# Altium project SMU_V4 - Copy.PrjPcb (part 2 of 2)

## Sheet Relay.SchDoc
size C; SheetNumber: 8; SheetTotal: 15
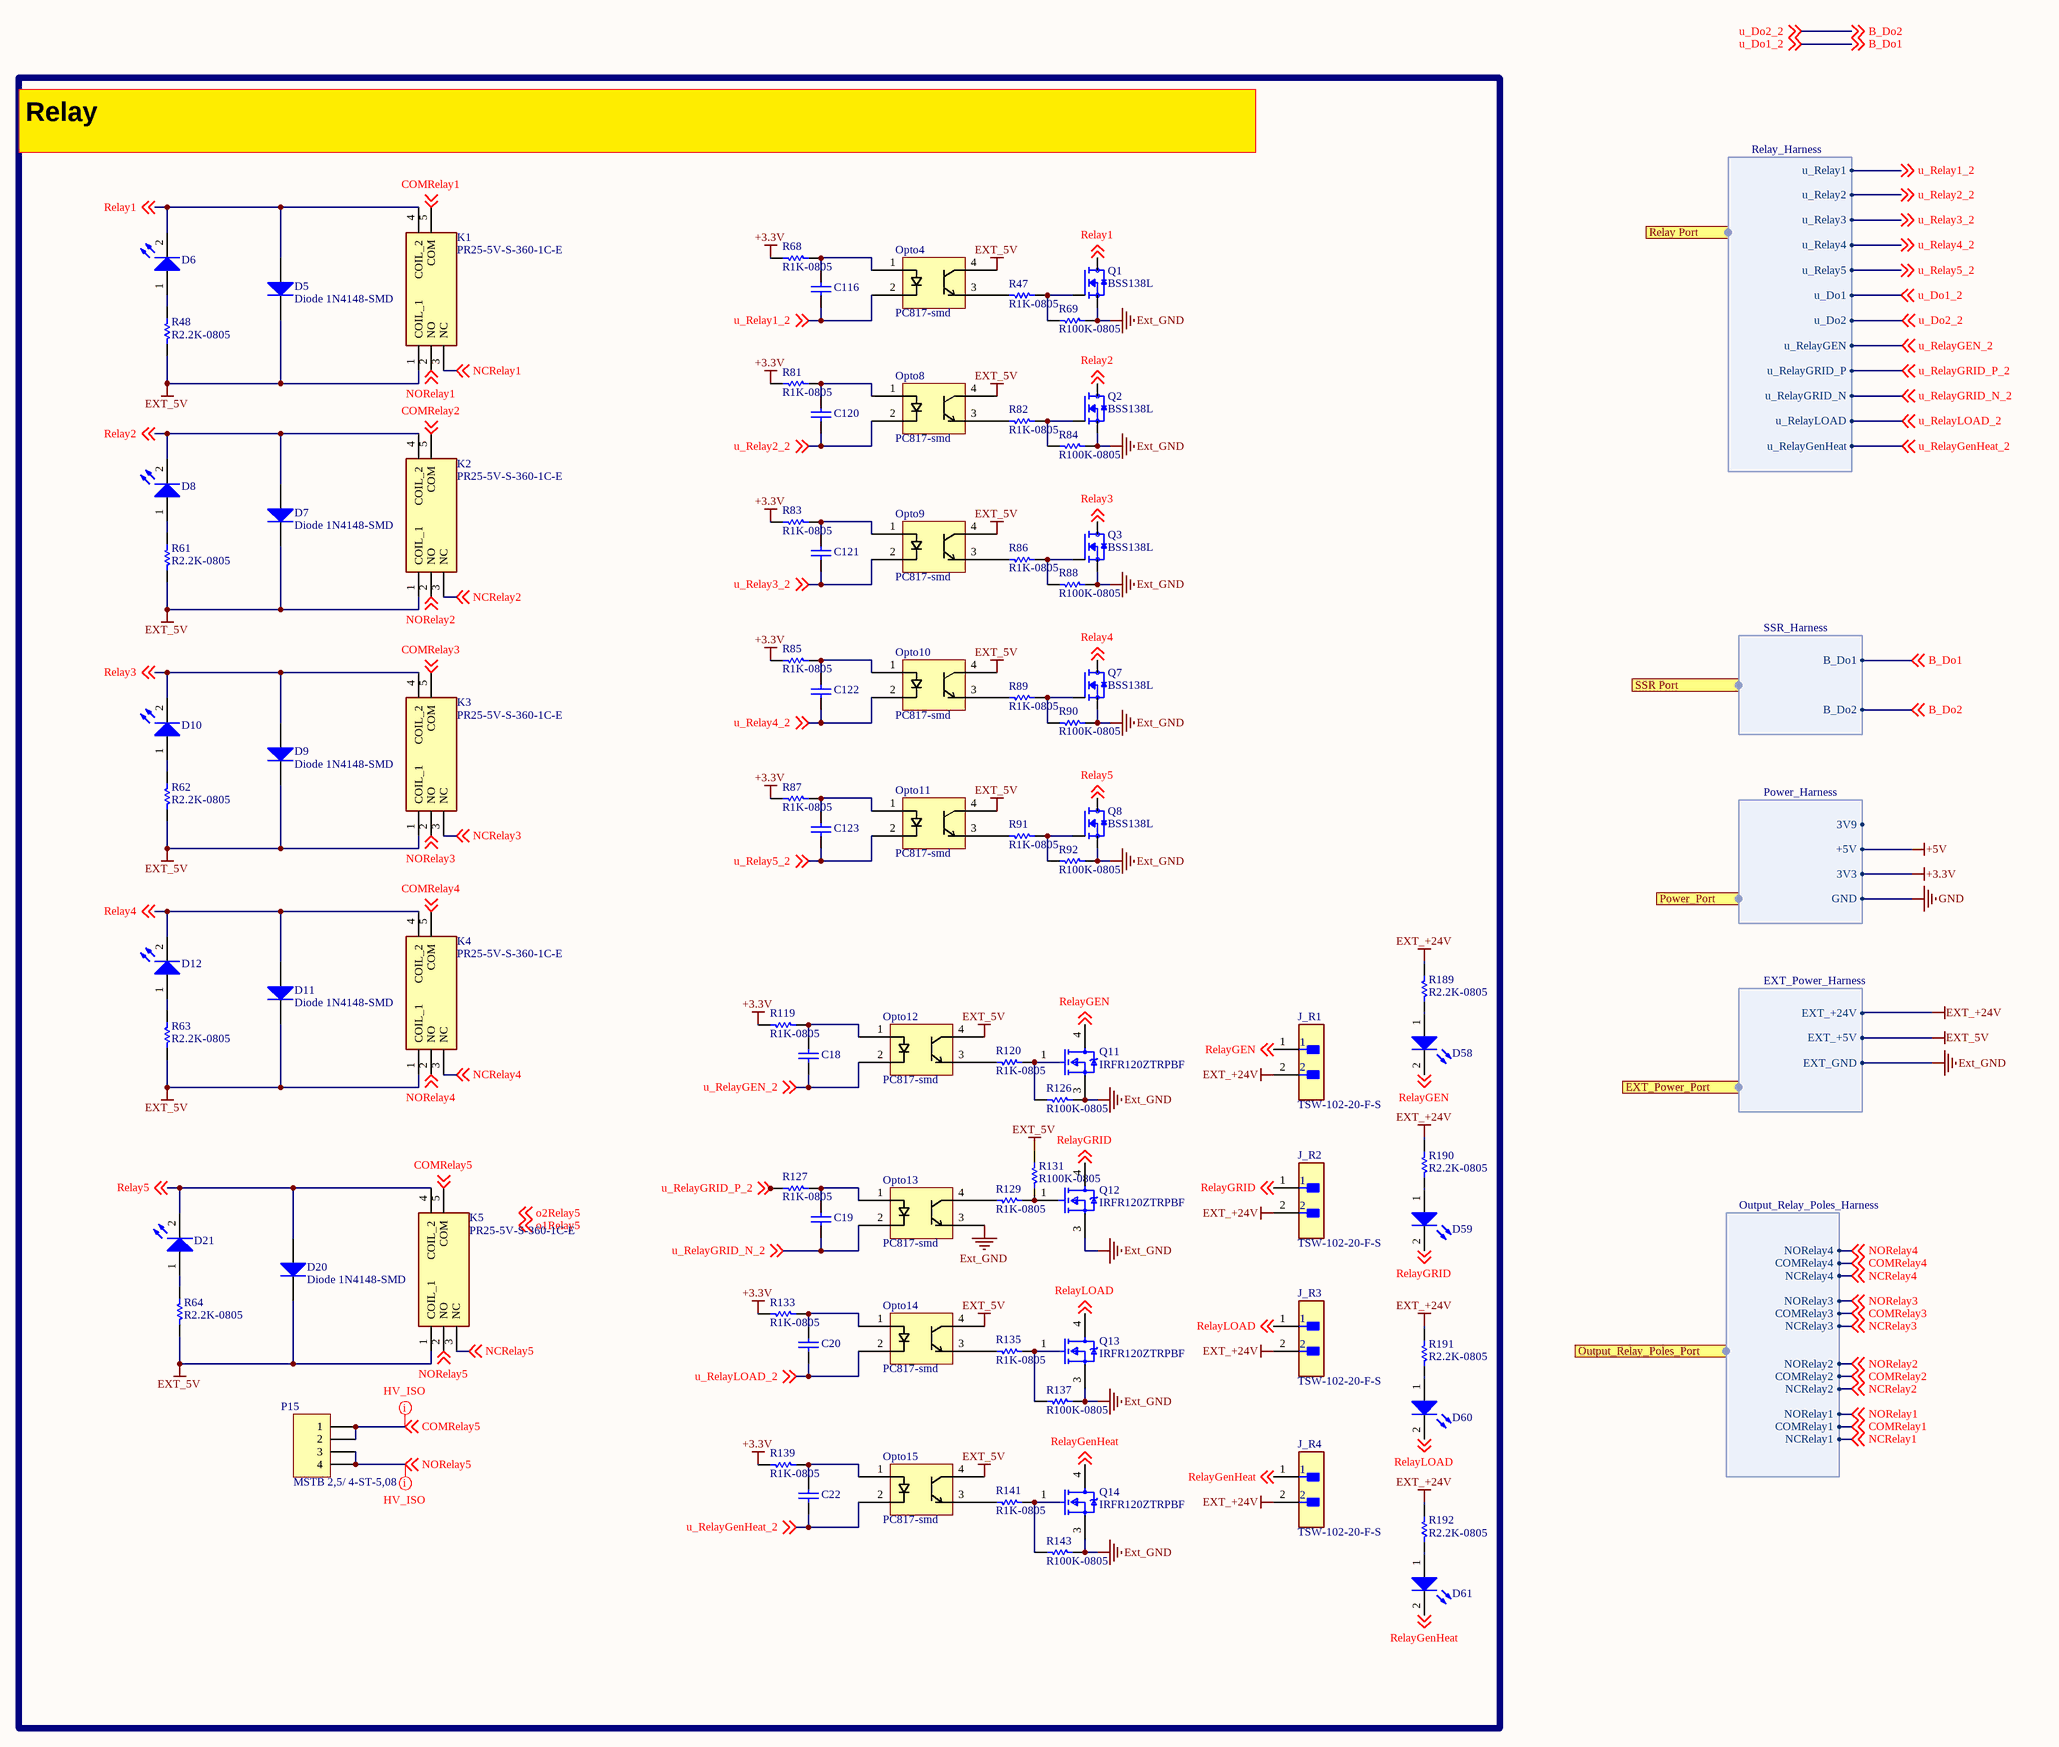
[diagram p7: Relay.SchDoc]

### Parts
C18  (no value)  [CRF06031]
C19  (no value)  [CRF06031]
C20  (no value)  [CRF06031]
C22  (no value)  [CRF06031]
C116  (no value)  [CRF06031]
C120  (no value)  [CRF06031]
C121  (no value)  [CRF06031]
C122  (no value)  [CRF06031]
C123  (no value)  [CRF06031]
D5  Diode 1N4148-SMD  [d1206]
D6  LED_0805_green  [0805-LED]  (value not drawn)
D7  Diode 1N4148-SMD  [d1206]
D8  LED_0805_green  [0805-LED]  (value not drawn)
D9  Diode 1N4148-SMD  [d1206]
D10  LED_0805_green  [0805-LED]  (value not drawn)
D11  Diode 1N4148-SMD  [d1206]
D12  LED_0805_green  [0805-LED]  (value not drawn)
D20  Diode 1N4148-SMD  [d1206]
D21  LED_0805_green  [0805-LED]  (value not drawn)
D58  LED_0805_green  [0805-LED]  (value not drawn)
D59  LED_0805_green  [0805-LED]  (value not drawn)
D60  LED_0805_green  [0805-LED]  (value not drawn)
D61  LED_0805_green  [0805-LED]  (value not drawn)
J_R1  TSW-102-20-F-S  [FP-TSW-102-12-T-S-MFG]
J_R2  TSW-102-20-F-S  [FP-TSW-102-12-T-S-MFG]
J_R3  TSW-102-20-F-S  [FP-TSW-102-12-T-S-MFG]
J_R4  TSW-102-20-F-S  [FP-TSW-102-12-T-S-MFG]
K1  PR25-5V-S-360-1C-E  [PR255VS3601CE]
K2  PR25-5V-S-360-1C-E  [PR255VS3601CE]
K3  PR25-5V-S-360-1C-E  [PR255VS3601CE]
K4  PR25-5V-S-360-1C-E  [PR255VS3601CE]
K5  PR25-5V-S-360-1C-E  [PR255VS3601CE]
Opto4  PC817-smd  [PC817_SMD1]
Opto8  PC817-smd  [PC817_SMD1]
Opto9  PC817-smd  [PC817_SMD1]
Opto10  PC817-smd  [PC817_SMD1]
Opto11  PC817-smd  [PC817_SMD1]
Opto12  PC817-smd  [PC817_SMD1]
Opto13  PC817-smd  [PC817_SMD1]
Opto14  PC817-smd  [PC817_SMD1]
Opto15  PC817-smd  [PC817_SMD1]
P15  MSTB 2,5/ 4-ST-5,08  [MSTB 2,5/4-G-5,08]
Q1  BSS138L  [BSS138L]
Q2  BSS138L  [BSS138L]
Q3  BSS138L  [BSS138L]
Q7  BSS138L  [BSS138L]
Q8  BSS138L  [BSS138L]
Q11  IRFR120ZTRPBF  [FP-PG-TO252-3-MFG]
Q12  IRFR120ZTRPBF  [FP-PG-TO252-3-MFG]
Q13  IRFR120ZTRPBF  [FP-PG-TO252-3-MFG]
Q14  IRFR120ZTRPBF  [FP-PG-TO252-3-MFG]
R47  R1K-0805  [CRF06031]
R48  R2.2K-0805  [CRF06031]
R61  R2.2K-0805  [CRF06031]
R62  R2.2K-0805  [CRF06031]
R63  R2.2K-0805  [CRF06031]
R64  R2.2K-0805  [CRF06031]
R68  R1K-0805  [CRF06031]
R69  R100K-0805  [CRF06031]
R81  R1K-0805  [CRF06031]
R82  R1K-0805  [CRF06031]
R83  R1K-0805  [CRF06031]
R84  R100K-0805  [CRF06031]
R85  R1K-0805  [CRF06031]
R86  R1K-0805  [CRF06031]
R87  R1K-0805  [CRF06031]
R88  R100K-0805  [CRF06031]
R89  R1K-0805  [CRF06031]
R90  R100K-0805  [CRF06031]
R91  R1K-0805  [CRF06031]
R92  R100K-0805  [CRF06031]
R119  R1K-0805  [CRF06031]
R120  R1K-0805  [CRF06031]
R126  R100K-0805  [CRF06031]
R127  R1K-0805  [CRF06031]
R129  R1K-0805  [CRF06031]
R131  R100K-0805  [CRF06031]
R133  R1K-0805  [CRF06031]
R135  R1K-0805  [CRF06031]
R137  R100K-0805  [CRF06031]
R139  R1K-0805  [CRF06031]
R141  R1K-0805  [CRF06031]
R143  R100K-0805  [CRF06031]
R189  R2.2K-0805  [CRF06031]
R190  R2.2K-0805  [CRF06031]
R191  R2.2K-0805  [CRF06031]
R192  R2.2K-0805  [CRF06031]

### Ports
EXT_Power_Port (harness EXT_Power_Harness), Output_Relay_Poles_Port (harness Output_Relay_Poles_Harness), Power_Port (harness Power_Harness), Relay Port (harness Relay_Harness), SSR Port (harness SSR_Harness)

### Harnesses
Relay_Harness: u_Relay1, u_Relay2, u_Relay3, u_Relay4, u_Relay5, u_Do1, u_Do2, u_RelayGEN, u_RelayGRID_P, u_RelayGRID_N, u_RelayLOAD, u_RelayGenHeat
SSR_Harness: B_Do1, B_Do2
Power_Harness: 3V9, +5V, 3V3, GND
EXT_Power_Harness: EXT_+24V, EXT_+5V, EXT_GND
Output_Relay_Poles_Harness: NCRelay1, NCRelay2, NCRelay3, NCRelay4, COMRelay1, COMRelay2, COMRelay3, COMRelay4, NORelay1, NORelay2, NORelay3, NORelay4

### Nets
+3.3V: R68.2 R81.2 R83.2 R85.2 R87.2 R119.2 R133.2 R139.2 ; port Power_Port.3V3
EXT_5V: D5.2(K) D7.2(K) D9.2(K) D11.2(K) D20.2(K) K1.1(COIL_1) K2.1(COIL_1) K3.1(COIL_1) K4.1(COIL_1) K5.1(COIL_1) Opto4.4 Opto8.4 Opto9.4 Opto10.4 Opto11.4 Opto12.4 Opto14.4 Opto15.4 R48.2 R61.2 R62.2 R63.2 R64.2 R131.2 ; port EXT_Power_Port.EXT_+5V
EXT_+24V: J_R1.2 J_R2.2 J_R3.2 J_R4.2 R189.2 R190.2 R191.2 R192.2 ; port EXT_Power_Port.EXT_+24V
Ext_GND: Opto13.3 Q1.S Q2.S Q3.S Q7.S Q8.S Q11.3(SOURCE) Q12.3(SOURCE) Q13.3(SOURCE) Q14.3(SOURCE) R69.2 R84.2 R88.2 R90.2 R92.2 R126.2 R137.2 R143.2 ; port EXT_Power_Port.EXT_GND
B_Do1: off-sheet B_Do1, off-sheet u_Do1_2, port Relay Port.u_Do1, port SSR Port.B_Do1  [also labelled u_Do1_2]
B_Do2: off-sheet B_Do2, off-sheet u_Do2_2, port Relay Port.u_Do2, port SSR Port.B_Do2  [also labelled u_Do2_2]
COMRelay1: K1.5(COM) ; off-sheet COMRelay1, port Output_Relay_Poles_Port.COMRelay1
COMRelay2: K2.5(COM) ; off-sheet COMRelay2, port Output_Relay_Poles_Port.COMRelay2
COMRelay3: K3.5(COM) ; off-sheet COMRelay3, port Output_Relay_Poles_Port.COMRelay3
COMRelay4: K4.5(COM) ; off-sheet COMRelay4, port Output_Relay_Poles_Port.COMRelay4
COMRelay5: K5.5(COM) P15.1 P15.2 ; off-sheet COMRelay5
NCRelay1: K1.3(NC) ; off-sheet NCRelay1, port Output_Relay_Poles_Port.NCRelay1
NCRelay2: K2.3(NC) ; off-sheet NCRelay2, port Output_Relay_Poles_Port.NCRelay2
NCRelay3: K3.3(NC) ; off-sheet NCRelay3, port Output_Relay_Poles_Port.NCRelay3
NCRelay4: K4.3(NC) ; off-sheet NCRelay4, port Output_Relay_Poles_Port.NCRelay4
NCRelay5: K5.3(NC) ; off-sheet NCRelay5
NORelay1: K1.2(NO) ; off-sheet NORelay1, port Output_Relay_Poles_Port.NORelay1
NORelay2: K2.2(NO) ; off-sheet NORelay2, port Output_Relay_Poles_Port.NORelay2
NORelay3: K3.2(NO) ; off-sheet NORelay3, port Output_Relay_Poles_Port.NORelay3
NORelay4: K4.2(NO) ; off-sheet NORelay4, port Output_Relay_Poles_Port.NORelay4
NORelay5: K5.2(NO) P15.3 P15.4 ; off-sheet NORelay5
Relay1: D5.1(A) D6.2(K) K1.4(COIL_2) Q1.D ; off-sheet Relay1
Relay2: D7.1(A) D8.2(K) K2.4(COIL_2) Q2.D ; off-sheet Relay2
Relay3: D9.1(A) D10.2(K) K3.4(COIL_2) Q3.D ; off-sheet Relay3
Relay4: D11.1(A) D12.2(K) K4.4(COIL_2) Q7.D ; off-sheet Relay4
Relay5: D20.1(A) D21.2(K) K5.4(COIL_2) Q8.D ; off-sheet Relay5
RelayGEN: D58.2(K) J_R1.1 Q11.4(DRAIN) ; off-sheet RelayGEN
RelayGenHeat: D61.2(K) J_R4.1 Q14.4(DRAIN) ; off-sheet RelayGenHeat
RelayGRID: D59.2(K) J_R2.1 Q12.4(DRAIN) ; off-sheet RelayGRID
RelayLOAD: D60.2(K) J_R3.1 Q13.4(DRAIN) ; off-sheet RelayLOAD
u_Relay1_2: C116.1 Opto4.2 ; off-sheet u_Relay1_2, port Relay Port.u_Relay1
u_Relay2_2: C120.1 Opto8.2 ; off-sheet u_Relay2_2, port Relay Port.u_Relay2
u_Relay3_2: C121.1 Opto9.2 ; off-sheet u_Relay3_2, port Relay Port.u_Relay3
u_Relay4_2: C122.1 Opto10.2 ; off-sheet u_Relay4_2, port Relay Port.u_Relay4
u_Relay5_2: C123.1 Opto11.2 ; off-sheet u_Relay5_2, port Relay Port.u_Relay5
u_RelayGEN_2: C18.1 Opto12.2 ; off-sheet u_RelayGEN_2, port Relay Port.u_RelayGEN
u_RelayGenHeat_2: C22.1 Opto15.2 ; off-sheet u_RelayGenHeat_2, port Relay Port.u_RelayGenHeat
u_RelayGRID_N_2: C19.1 Opto13.2 ; off-sheet u_RelayGRID_N_2, port Relay Port.u_RelayGRID_N
u_RelayGRID_P_2: R127.2 ; off-sheet u_RelayGRID_P_2, port Relay Port.u_RelayGRID_P
u_RelayLOAD_2: C20.1 Opto14.2 ; off-sheet u_RelayLOAD_2, port Relay Port.u_RelayLOAD
NetC18_2: C18.2 Opto12.1 R119.1
NetC19_2: C19.2 Opto13.1 R127.1
NetC20_2: C20.2 Opto14.1 R133.1
NetC22_2: C22.2 Opto15.1 R139.1
NetC116_2: C116.2 Opto4.1 R68.1
NetC120_2: C120.2 Opto8.1 R81.1
NetC121_2: C121.2 Opto9.1 R83.1
NetC122_2: C122.2 Opto10.1 R85.1
NetC123_2: C123.2 Opto11.1 R87.1
NetD6_1: D6.1(A) R48.1
NetD8_1: D8.1(A) R61.1
NetD10_1: D10.1(A) R62.1
NetD12_1: D12.1(A) R63.1
NetD21_1: D21.1(A) R64.1
NetD58_1: D58.1(A) R189.1
NetD59_1: D59.1(A) R190.1
NetD60_1: D60.1(A) R191.1
NetD61_1: D61.1(A) R192.1
NetOpto4_3: Opto4.3 R47.2
NetOpto8_3: Opto8.3 R82.2
NetOpto9_3: Opto9.3 R86.2
NetOpto10_3: Opto10.3 R89.2
NetOpto11_3: Opto11.3 R91.2
NetOpto12_3: Opto12.3 R120.2
NetOpto13_4: Opto13.4 R129.2
NetOpto14_3: Opto14.3 R135.2
NetOpto15_3: Opto15.3 R141.2
NetQ1_G: Q1.G R47.1 R69.1
NetQ2_G: Q2.G R82.1 R84.1
NetQ3_G: Q3.G R86.1 R88.1
NetQ7_G: Q7.G R89.1 R90.1
NetQ8_G: Q8.G R91.1 R92.1
NetQ11_1: Q11.1(GATE) R120.1 R126.1
NetQ12_1: Q12.1(GATE) R129.1 R131.1
NetQ13_1: Q13.1(GATE) R135.1 R137.1
NetQ14_1: Q14.1(GATE) R141.1 R143.1

### Layout directives
net class HV_ISO: COMRelay5, NORelay5

### Notes on the sheet
- Relay
- Labels drawn without touching a wire or pin: o1Relay5, o2Relay5

### Library data of the parts
C18-C20 C22 C116 C120-C123 = Cap: as C1 on sheet Memory; Digi-Key_Part_Number: 490-4789-1-ND; JLC P/N: C85866
  C116 C120-C122: ClassName: OutputRelays
  C123: ClassName: HeaterRelay
D5 D7 D9 D11 D20 = Diode 1N4934: as D34 on sheet SSR; Digi-Key_Part_Number: 1N4148WSFSTR-ND; JLC P/N: C2128
  D5 D7 D9 D11: ClassName: OutputRelays
  D20: ClassName: HeaterRelay
D6 D8 D10 D12 D21 D58-D61 = LED_0805: Manufacturer_P/N: NCD0805R1; JLC P/N: C84256
  D6 D8 D10 D12: ClassName: OutputRelays
  D21: ClassName: HeaterRelay
J_R1-J_R4 = CMP-02766-001444-1: CONN HEADER VERT 2POS 2.54MM; Mount: Through Hole; Digi-Key_Part_Number: TSW-102-20-F-S-ND; Manufacturer_P/N: TSW-102-20-F-S; JLC P/N: C5993367
K1-K5 = PR25-5V-S-360-1C-E: Relay or Contactor; Manufacturer_Name: Same Sky; Manufacturer_Part_Number: PR25-5V-S-360-1C-E; Mouser Part Number: 179-PR255VS3601CE; Arrow Part Number: PR25-5V-S-360-1C-E; Digi-Key_Part_Number: 2223-PR25-5V-S-360-1C-E-ND; Manufacturer_P/N: PR25-5V-S-360-1C-E; JLC P/N: C35750544
  K1-K4: ClassName: OutputRelays
  K5: ClassName: HeaterRelay
Opto4 Opto8-Opto15 = PC817: Manufacturer_P/N: APC-817D1-SL; Digi-Key_Part_Number: 2007-APC-817D1-SLTR-ND; JLC P/N: C17448553
  Opto4 Opto8-Opto10: ClassName: OutputRelays
  Opto11: ClassName: HeaterRelay
P15 = Header 4: Conn Phonix,4 Pitch: 5.08 mm; Manufacturer_P/N: 1757268; Digi-Key_Part_Number: 277-1108-ND; JLC P/N: C90076
Q1-Q3 Q7 Q8 = BSS138L: smd; MF: ON Semiconductor; MP: BSS138L; Digi-Key_Part_Number: BSS138LTR-ND; Manufacturer_P/N: BSS138L; JLC P/N: C890265
  Q1-Q3 Q7: ClassName: OutputRelays
  Q8: ClassName: HeaterRelay
Q11-Q14 = CMP-32901-000780-1: MOSFET N-CH 100V 8.7A DPAK; Min Operating Temperature: -55°C; Mount: Surface Mount; Digi-Key_Part_Number: IRFR120ZTRPBFTR-ND; Manufacturer_P/N: IRFR120ZTRPBF; JLC P/N: C537949
R47 R68 R81-R83 R85-R87 R89 R91 R119 R120 R127 R129 R133 R135 R139 R141 = Res1: as R66 on sheet Power; Digi-Key_Part_Number: 311-1.00KCRTR-ND; JLC P/N: C95781
  R47 R68 R81-R83 R85 R86 R89: ClassName: OutputRelays
  R87 R91: ClassName: HeaterRelay
R48 R61-R64 R189-R192 = Res1: as R35 on sheet Power; Digi-Key_Part_Number: 311-2.20KCRTR-ND; JLC P/N: C114561
  R48 R61-R63: ClassName: OutputRelays
  R64: ClassName: HeaterRelay
R69 R84 R88 R90 R92 R126 R131 R137 R143 = Res1: Resistor; Manufacturer_P/N: RC0805FR-07100KL; Digi-Key_Part_Number: 311-100KCRTR-ND; JLC P/N: C96346
  R69 R84 R88 R90: ClassName: OutputRelays
  R92: ClassName: HeaterRelay

## Sheet Comm.SchDoc
size C; SheetNumber: 4; SheetTotal: 15
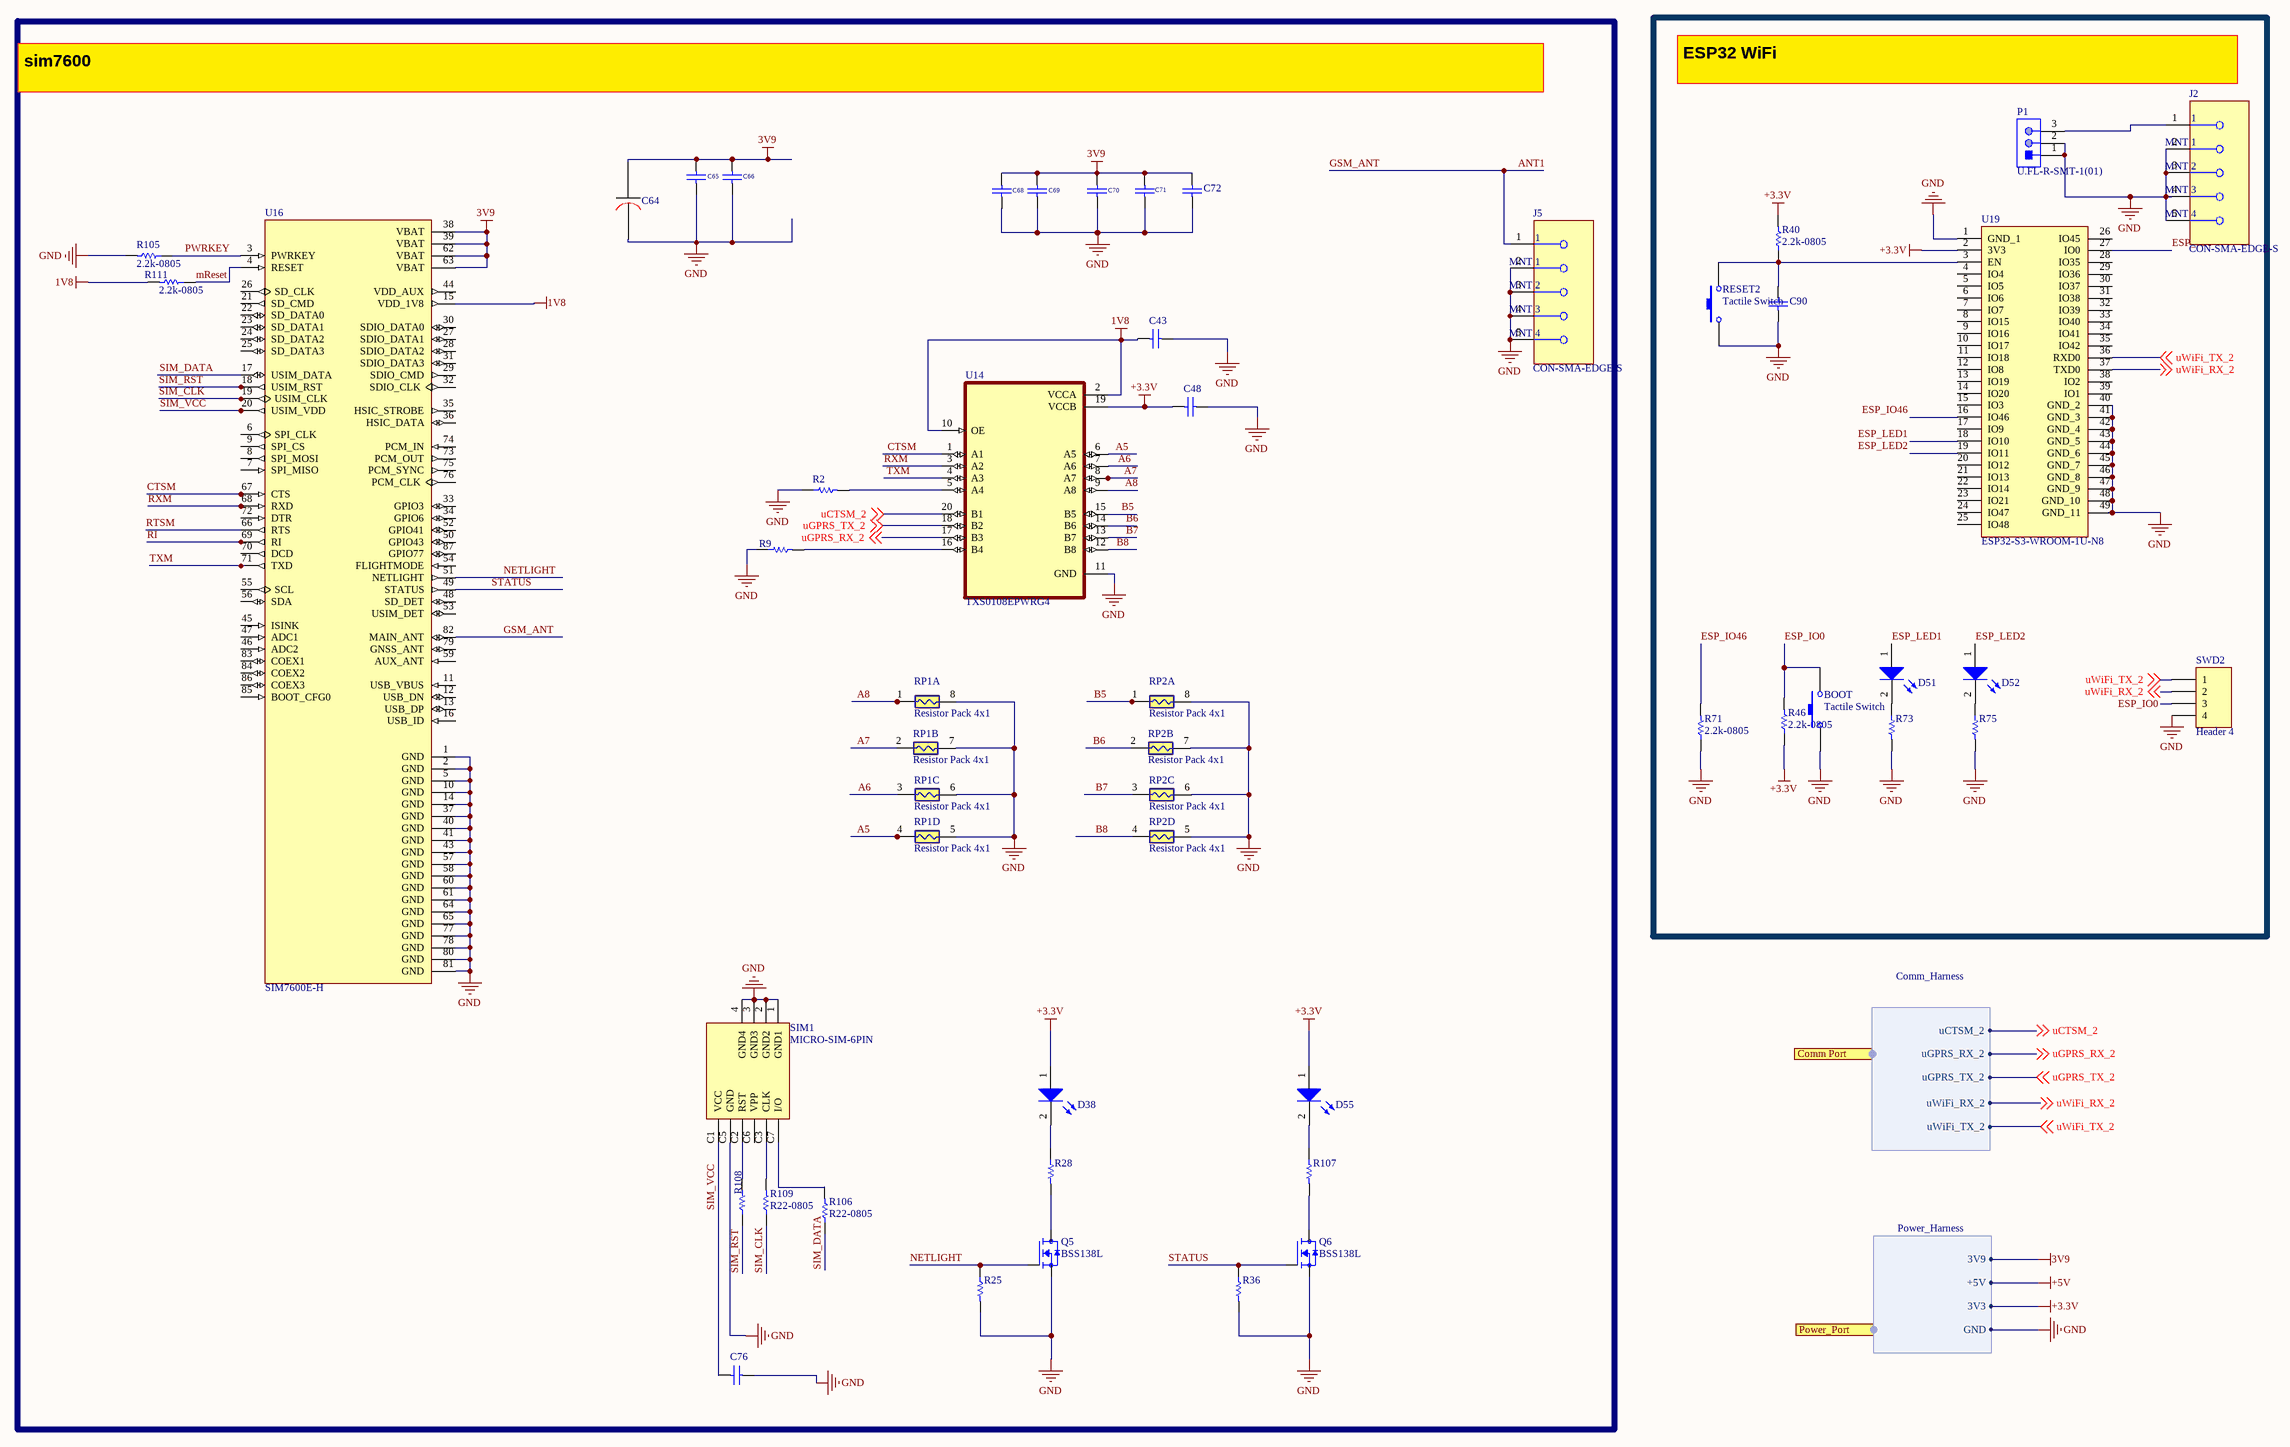
[diagram p8: Comm.SchDoc]

### Parts
BOOT  Tactile Switch  [CRF06031]
C43  Cap  [CRF06031]  (value not drawn)
C48  Cap  [CRF06031]  (value not drawn)
C64  470uF-10V  [CAPACITOR RADIAL SMT size F]  (value not drawn)
C65  (no value)  [CRF06031]
C66  (no value)  [CRF06031]
C68  (no value)  [CRF06031]
C69  (no value)  [CRF06031]
C70  (no value)  [CRF06031]
C71  (no value)  [CRF06031]
C72  (no value)  [CRF06031]
C76  (no value)  [CRF06031]
C90  (no value)  [CRF06031]
D38  LED_0805_green  [0805-LED]  (value not drawn)
D51  LED_0805_green  [0805-LED]  (value not drawn)
D52  LED_0805_green  [0805-LED]  (value not drawn)
D55  LED_0805_green  [0805-LED]  (value not drawn)
J2  CON-SMA-EDGE-S  [FP-CON-SMA-EDGE-S-MFG]
J5  CON-SMA-EDGE-S  [FP-CON-SMA-EDGE-S-MFG]
P1  U.FL-R-SMT-1(01)  [HRS-U.FL-R-SMT-3_V]
Q5  BSS138L  [BSS138L]
Q6  BSS138L  [BSS138L]
R2  (no value)  [CRF06031]
R9  (no value)  [CRF06031]
R25  (no value)  [crf06031]
R28  (no value)  [CRF06031]
R36  (no value)  [crf06031]
R40  2.2k-0805  [CRF06031]
R46  2.2k-0805  [CRF06031]
R71  2.2k-0805  [CRF06031]
R73  (no value)  [CRF06031]
R75  (no value)  [CRF06031]
R105  2.2k-0805  [CRF06031]
R106  R22-0805  [CRF06031]
R107  (no value)  [CRF06031]
R108  R22-0805  [CRF06031]  (value not drawn)
R109  R22-0805  [CRF06031]
R111  2.2k-0805  [CRF06031]
RESET2  Tactile Switch  [CRF06031]
RP1  Resistor Pack 4x1  [RP4x0603]  (parts A,B,C,D of 4)
RP2  Resistor Pack 4x1  [RP4x0603]  (parts A,B,C,D of 4)
SIM1  MICRO-SIM-6PIN  [MICRO-SIM-6PIN]
SWD2  Header 4  [HDR1X4]
U14  TXS0108EPWRG4  [SOP65P640X120-20N]
U16  SIM7600E-H  [IC_SIM7600E-H]
U19  ESP32-S3-WROOM-1U-N8  [ESP32S3WROOM1UN8]

### Ports
Comm Port (harness Comm_Harness), Power_Port (harness Power_Harness)

### Harnesses
Comm_Harness: uCTSM_2, uGPRS_RX_2, uGPRS_TX_2, uWiFi_TX_2, uWiFi_RX_2
Power_Harness: 3V9, +5V, 3V3, GND

### Nets
1V8: C43.1 R111.2 U14.2(VCCA) U14.10(OE) U16.15(VDD_1V8)
3V9: C64.1 C65.2 C66.2 C68.2 C69.2 C70.2 C71.2 C72.2 U16.38(VBAT) U16.39(VBAT) U16.62(VBAT) U16.63(VBAT) ; port Power_Port.3V9
+3.3V: C48.1 D38.1(A) D55.1(A) R40.2 R46.1 U14.19(VCCB) U19.2(3V3) ; port Power_Port.3V3
GND: BOOT.1 C43.2 C48.2 C64.2 C65.1 C66.1 C68.1 C69.1 C70.1 C71.1 C72.1 C76.1 C90.1 J2.2(MNT_1) J2.3(MNT_2) J2.4(MNT_3) J2.5(MNT_4) J5.2(MNT_1) J5.3(MNT_2) J5.4(MNT_3) J5.5(MNT_4) P1.1 P1.2 Q5.S Q6.S R2.1 R9.1 R25.2 R36.2 R71.1 R73.2 R75.2 R105.2 RESET2.1 RP1.5 RP1.6 RP1.7 RP1.8 RP2.5 RP2.6 RP2.7 RP2.8 SIM1.1(GND1) SIM1.2(GND2) SIM1.3(GND3) SIM1.4(GND4) SIM1.C5(GND) SWD2.4 U14.11(GND) U16.1(GND) U16.2(GND) U16.5(GND) U16.10(GND) U16.14(GND) U16.37(GND) U16.40(GND) U16.41(GND) U16.43(GND) U16.57(GND) U16.58(GND) U16.60(GND) U16.61(GND) U16.64(GND) U16.65(GND) U16.77(GND) U16.78(GND) U16.80(GND) U16.81(GND) U19.1(GND_1) U19.40(GND_2) U19.41(GND_3) U19.42(GND_4) U19.43(GND_5) U19.44(GND_6) U19.45(GND_7) U19.46(GND_8) U19.47(GND_9) U19.48(GND_10) U19.49(GND_11) ; port Power_Port.GND
A5: RP1.4 U14.6(A5)
A6: RP1.3 U14.7(A6)
A7: RP1.2 U14.8(A7)
A8: RP1.1 U14.9(A8)
ANT1: J5.1 U16.82(MAIN_ANT)  [also labelled GSM_ANT]
B5: RP2.1 U14.15(B5)
B6: RP2.2 U14.14(B6)
B7: RP2.3 U14.13(B7)
B8: RP2.4 U14.12(B8)
CTSM: U14.1(A1) U16.67(CTS)
ESP_IO0: BOOT.2 R46.2 SWD2.3 U19.27(IO0)
ESP_IO46: R71.2 U19.16(IO46)
ESP_LED1: D51.1(A) U19.18(IO10)
ESP_LED2: D52.1(A) U19.19(IO11)
mReset: R111.1 U16.4(RESET)
NETLIGHT: Q5.G R25.1 U16.51(NETLIGHT)
PWRKEY: R105.1 U16.3(PWRKEY)
RI: U16.69(RI)
RTSM: U16.66(RTS)
RXM: U14.3(A2) U16.68(RXD)
SIM_CLK: R109.1 U16.19(USIM_CLK)
SIM_DATA: R106.1 U16.17(USIM_DATA)
SIM_RST: R108.1 U16.18(USIM_RST)
SIM_VCC: C76.2 SIM1.C1(VCC) U16.20(USIM_VDD)
STATUS: Q6.G R36.1 U16.49(STATUS)
TXM: U14.4(A3) U16.71(TXD)
uCTSM_2: U14.20(B1) ; off-sheet uCTSM_2, port Comm Port.uCTSM_2
uGPRS_RX_2: U14.17(B3) ; off-sheet uGPRS_RX_2, port Comm Port.uGPRS_RX_2
uGPRS_TX_2: U14.18(B2) ; off-sheet uGPRS_TX_2, port Comm Port.uGPRS_TX_2
uWiFi_RX_2: SWD2.2 U19.37(TXD0) ; off-sheet uWiFi_RX_2, port Comm Port.uWiFi_RX_2
uWiFi_TX_2: SWD2.1 U19.36(RXD0) ; off-sheet uWiFi_TX_2, port Comm Port.uWiFi_TX_2
NetC90_2: C90.2 R40.1 RESET2.2 U19.3(EN)
NetD38_2: D38.2(K) R28.1
NetD51_2: D51.2(K) R73.1
NetD52_2: D52.2(K) R75.1
NetD55_2: D55.2(K) R107.1
NetJ2_1: J2.1 P1.3
NetQ5_D: Q5.D R28.2
NetQ6_D: Q6.D R107.2
NetR2_2: R2.2 U14.5(A4)
NetR9_2: R9.2 U14.16(B4)
NetR106_2: R106.2 SIM1.C7(I/O)
NetR108_2: R108.2 SIM1.C2(RST)
NetR109_2: R109.2 SIM1.C3(CLK)

Not connected (* = marked no-connect by the designer): SIM1 C6(VPP); U16 6(SPI_CLK) 7(SPI_MISO) 8(SPI_MOSI) 9(SPI_CS) 11(USB_VBUS) 12(USB_DN) 13(USB_DP) 16(USB_ID) 21(SD_CMD) 22(SD_DATA0) 23(SD_DATA1) 24(SD_DATA2) 25(SD_DATA3) 26(SD_CLK) 27(SDIO_DATA1) 28(SDIO_DATA2) 29(SDIO_CMD) 30(SDIO_DATA0) 31(SDIO_DATA3) 32(SDIO_CLK) 33(GPIO3) 34(GPIO6) 35(HSIC_STROBE) 36(HSIC_DATA) 44(VDD_AUX) 45(ISINK) 46(ADC2) 47(ADC1) 48(SD_DET) 50(GPIO43) 52(GPIO41) 53(USIM_DET) 54(FLIGHTMODE) 55(SCL) 56(SDA) 59(AUX_ANT) 70(DCD) 72(DTR) 73(PCM_OUT) 74(PCM_IN) 75(PCM_SYNC) 76(PCM_CLK) 79(GNSS_ANT) 83(COEX1) 84(COEX2) 85(BOOT_CFG0) 86(COEX3) 87(GPIO77); U19 4(IO4) 5(IO5) 6(IO6) 7(IO7) 8(IO15) 9(IO16) 10(IO17) 11(IO18) 12(IO8) 13(IO19) 14(IO20) 15(IO3) 17(IO9) 20(IO12) 21(IO13) 22(IO14) 23(IO21) 24(IO47) 25(IO48) 26(IO45) 28(IO35) 29(IO36) 30(IO37) 31(IO38) 32(IO39) 33(IO40) 34(IO41) 35(IO42) 38(IO2) 39(IO1)

### Notes on the sheet
- sim7600
- ESP32 WiFi

### Library data of the parts
BOOT RESET2 = Switch PB: Manufacturer_P/N: 430152043836; ClassName: WiFi-ESP32; Digi-Key_Part_Number: 732-6992-2-ND; JLC P/N: C6687535
C43 C48 C65 C66 C68-C72 C76 = Cap: as C1 on sheet Memory; Digi-Key_Part_Number: 490-4789-1-ND; ClassName: Sim7600; JLC P/N: C85866
C64 = CAP_E_SMD: SMD_Electrolyt; Manufacturer_P/N: EEE-HC1H101P; Digi-Key_Part_Number: P19732TR-ND; ClassName: Sim7600; JLC P/N: C336718
C90 = Cap: Capacitor; Manufacturer_P/N: GRM21BC72A105KE01L; ClassName: WiFi-ESP32; Digi-Key_Part_Number: 490-14464-2-ND; JLC P/N: C385039
D38 D51 D52 D55 = LED_0805: Manufacturer_P/N: NCD0805R1; JLC P/N: C84256
  D38 D55: ClassName: Sim7600
  D51 D52: ClassName: WiFi-ESP32
J2 J5 = CMP-204357-000001-1: CONN SMA JACK STR EDGE MNT; Octopart: https://octopart.com/con-sma-edge-s-rf+solutions-70967450; Manufacturer Part Number: CON-SMA-EDGE-S; Digikey Description: CONN SMA JACK STR EDGE MNT; Digi-Key_Part_Number: CON-SMA-EDGE-S-ND; Manufacturer_P/N: CON-SMA-EDGE-S; JLC P/N: C5356059
P1 = CMP-2000-05153-1: Ultra Small Coaxial Connector, 6 GHz, -40 to 90 degC, 3-Pin SMD, RoHS, Bulk; Minimum Quantity: UltraMiniatureCoaxial; Manufacturer URL: https://www.hirose.com; Quantity Available: Bulk; Digi-Key_Part_Number: 26-U.FL-R-SMT-1(01)-ND; Manufacturer_P/N: U.FL-R-SMT-1(01); JLC P/N: C598199
Q5 Q6 = BSS138L: smd; MF: ON Semiconductor; MP: BSS138L; Digi-Key_Part_Number: BSS138LTR-ND; ClassName: Sim7600; Manufacturer_P/N: BSS138L; JLC P/N: C890265
R2 R9 = ERQF06: smd; Manufacturer_P/N: RC0805FR-0747KL; Digi-Key_Part_Number: 311-47.0KCRTR-ND; ClassName: Sim7600; JLC P/N: C126351
R25 R28 R36 R73 R75 R107 = ERQF06: smd; Manufacturer_P/N: RC0805FR-074K7L; Digi-Key_Part_Number: 311-4.70KCRTR-ND; JLC P/N: C60816
  R25 R28 R36 R107: ClassName: Sim7600
  R73 R75: ClassName: WiFi-ESP32
R40 R46 R71 R105 R111 = Res1: as R35 on sheet Power; Digi-Key_Part_Number: 311-2.20KCRTR-ND; JLC P/N: C114561
  R40 R46 R71: ClassName: WiFi-ESP32
  R105 R111: ClassName: Sim7600
R106 R108 R109 = Res1: Resistor; Manufacturer_P/N: RC0805FR-0722RL; Digi-Key_Part_Number: 311-22.0CRTR-ND; ClassName: Sim7600; JLC P/N: C107702
RP1 RP2 = Resistor Pack 4*1: Manufacturer_P/N: YC164-JR-0710KL; Digi-Key_Part_Number: YC164J-10KTR-ND; ClassName: Sim7600; JLC P/N: C107374
SIM1 = MICRO-SIM-6PIN: Manufacturer_P/N: MSIM-2-A; Digi-Key_Part_Number: 2223-MSIM-2-ATR-ND; ClassName: Sim7600; JLC P/N: C37170261
SWD2 = Header 4: Header, 4-Pin; ClassName: WiFi-ESP32
U14 = TXS0108EPWRG4: 8-bit bidirectional voltage-level shifter for open-drain and push-pull application 20-TSSOP -40 to 85; MF: Texas Instruments; MP: TXS0108EPWRG4; Purchase-URL: https://pricing.snapeda.com/search/part/TXS0108EPWRG4/?ref=eda; Digi-Key_Part_Number: 296-23011-2-ND; Supplier 1: Mouser; Supplier Part Number 1: 595-TXS0108EPWRG4; ClassName: Sim7600_LevelShifter; Manufacturer_P/N: TXS0108EPWR; JLC P/N: C17206
U16 = SIM7600E-H: Multi-Band LTE-TDD/LTE-FDD/HSPA+ and GSM/GPRS/EDGE module; MP: SIM7600E-H; Digi-Key_Part_Number: 3781-SIM7600E-H-ND; Supplier 1: Digikey; Supplier Part Number 1: 3781-SIM7600E-H-ND; ClassName: Sim7600; Manufacturer_P/N: SIM7600E-H; JLC P/N: C5338795
U19 = ESP32-S3-WROOM-1U-N8: Integrated Circuit; Manufacturer_Name: Espressif Systems; Manufacturer_Part_Number: ESP32-S3-WROOM-1U-N8; Mouser Part Number: 356-ESP32S3WROOM1UN8; Digi-Key_Part_Number: 1965-ESP32-S3-WROOM-1U-N8TR-ND; ClassName: WiFi-ESP32; Manufacturer_P/N: ESP32-S3-WROOM-1U-N8; JLC P/N: C2980297

## Sheet DigitalInputs.SchDoc
size C; SheetNumber: 6; SheetTotal: 15
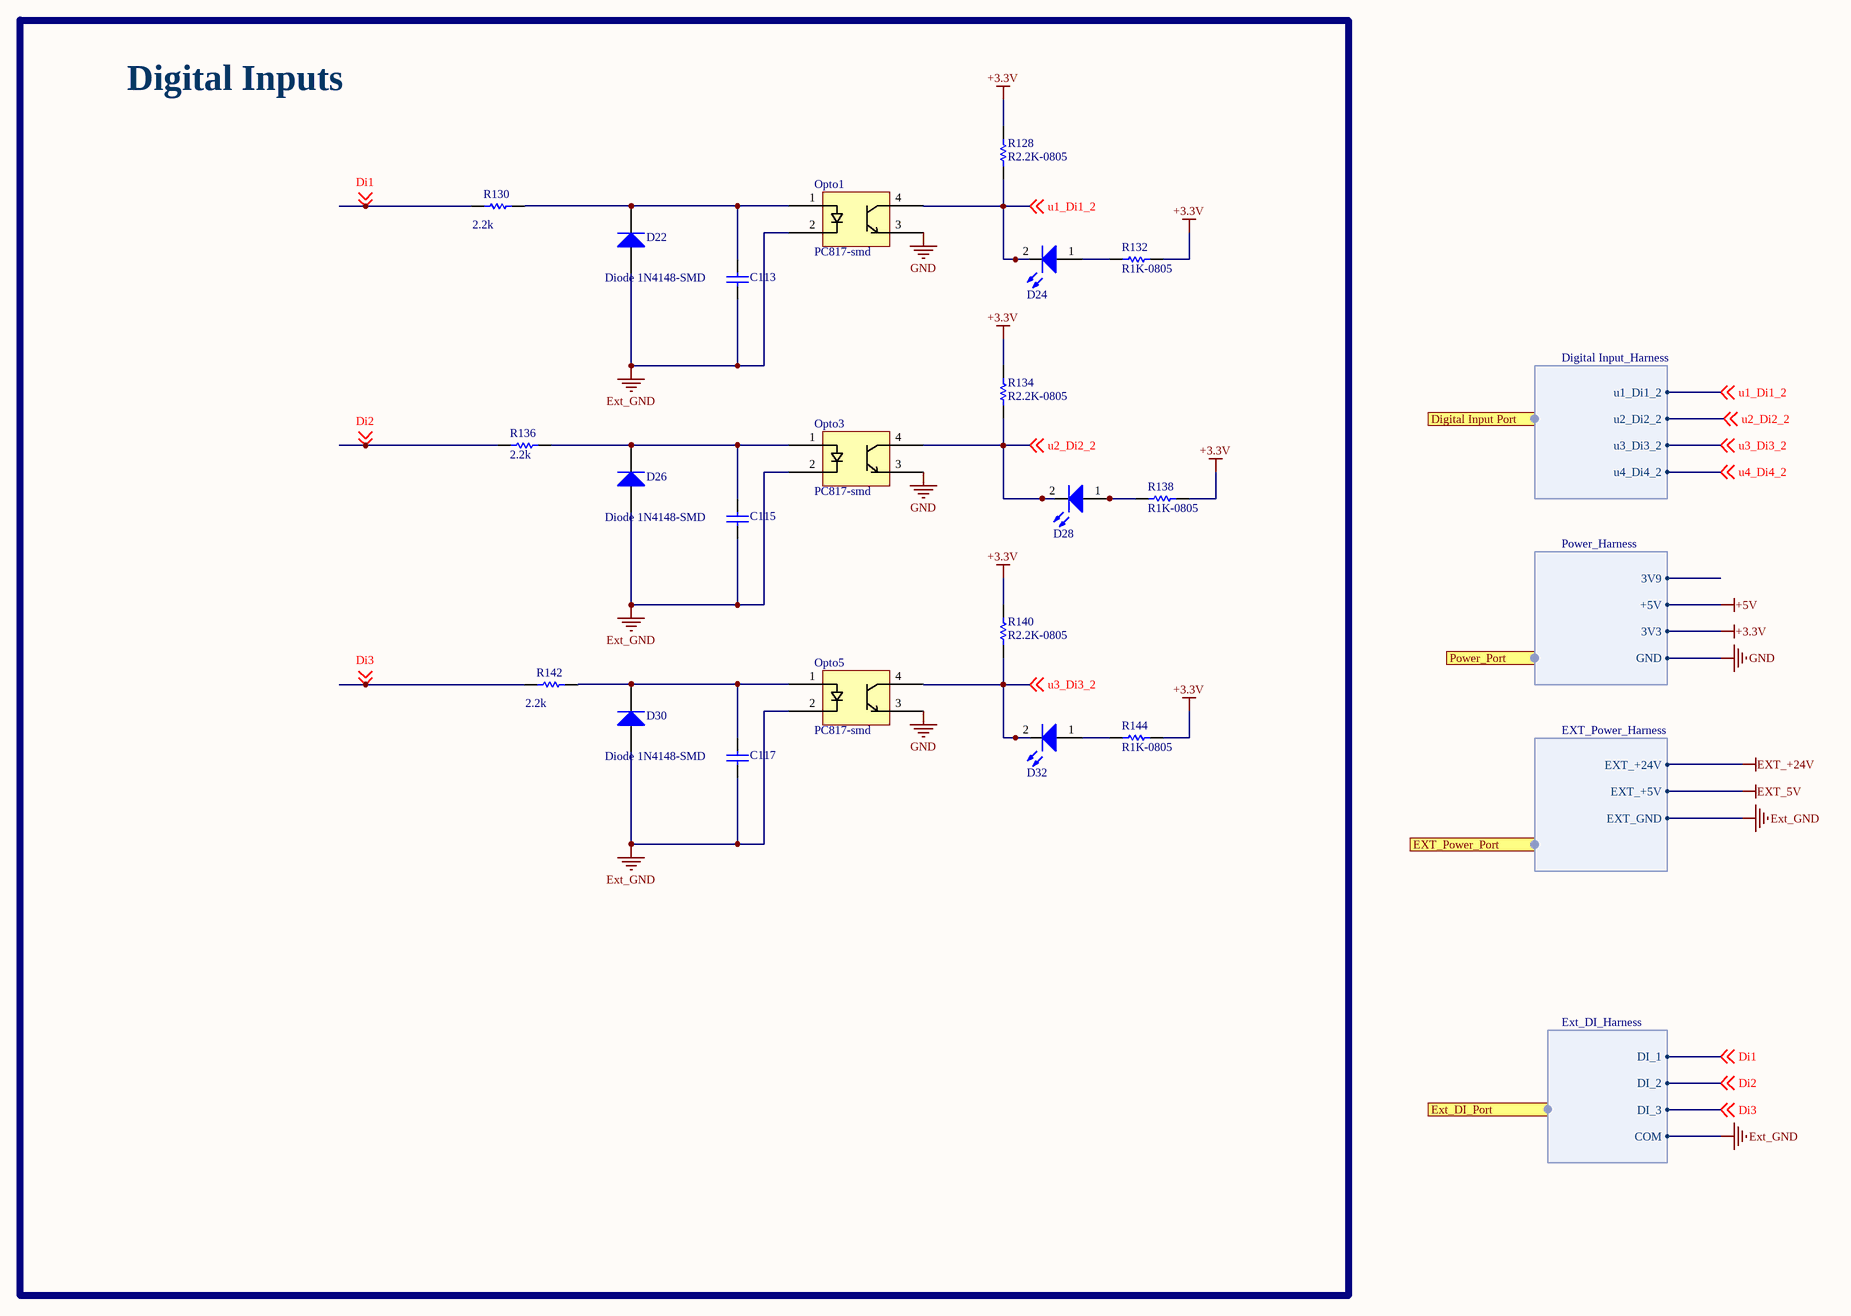
[diagram p9: DigitalInputs.SchDoc]

### Parts
C113  (no value)  [CRF06031]
C115  (no value)  [CRF06031]
C117  (no value)  [CRF06031]
D22  Diode 1N4148-SMD  [d1206]
D24  LED_0805_green  [0805-LED]  (value not drawn)
D26  Diode 1N4148-SMD  [d1206]
D28  LED_0805_green  [0805-LED]  (value not drawn)
D30  Diode 1N4148-SMD  [d1206]
D32  LED_0805_green  [0805-LED]  (value not drawn)
Opto1  PC817-smd  [PC817_SMD1]
Opto3  PC817-smd  [PC817_SMD1]
Opto5  PC817-smd  [PC817_SMD1]
R128  R2.2K-0805  [CRF06031]
R130  2.2k  [r1210]
R132  R1K-0805  [CRF06031]
R134  R2.2K-0805  [CRF06031]
R136  2.2k  [r1210]
R138  R1K-0805  [CRF06031]
R140  R2.2K-0805  [CRF06031]
R142  2.2k  [r1210]
R144  R1K-0805  [CRF06031]

### Ports
Digital Input Port (harness Digital Input_Harness), Ext_DI_Port (harness Ext_DI_Harness), EXT_Power_Port (harness EXT_Power_Harness), Power_Port (harness Power_Harness)

### Harnesses
Digital Input_Harness: u1_Di1_2, u2_Di2_2, u3_Di3_2, u4_Di4_2
EXT_Power_Harness: EXT_+24V, EXT_+5V, EXT_GND
Power_Harness: 3V9, +5V, 3V3, GND
Ext_DI_Harness: DI_1, DI_2, DI_3, COM

### Nets
+3.3V: R128.1 R132.1 R134.1 R138.1 R140.1 R144.1 ; port Power_Port.3V3
Ext_GND: C113.1 C115.1 C117.1 D22.1(A) D26.1(A) D30.1(A) Opto1.2 Opto3.2 Opto5.2 ; port EXT_Power_Port.EXT_GND, port Ext_DI_Port.COM
GND: Opto1.3 Opto3.3 Opto5.3 ; port Power_Port.GND
Di1: R130.1 ; off-sheet Di1, port Ext_DI_Port.DI_1
Di2: R136.1 ; off-sheet Di2, port Ext_DI_Port.DI_2
Di3: R142.1 ; off-sheet Di3, port Ext_DI_Port.DI_3
u1_Di1_2: D24.2(K) Opto1.4 R128.2 ; off-sheet u1_Di1_2, port Digital Input Port.u1_Di1_2
u2_Di2_2: D28.2(K) Opto3.4 R134.2 ; off-sheet u2_Di2_2, port Digital Input Port.u2_Di2_2
u3_Di3_2: D32.2(K) Opto5.4 R140.2 ; off-sheet u3_Di3_2, port Digital Input Port.u3_Di3_2
u4_Di4_2: off-sheet u4_Di4_2, port Digital Input Port.u4_Di4_2
NetC113_2: C113.2 D22.2(K) Opto1.1 R130.2
NetC115_2: C115.2 D26.2(K) Opto3.1 R136.2
NetC117_2: C117.2 D30.2(K) Opto5.1 R142.2
NetD24_1: D24.1(A) R132.2
NetD28_1: D28.1(A) R138.2
NetD32_1: D32.1(A) R144.2

### Notes on the sheet
- Digital Inputs

### Library data of the parts
C113 C115 C117 = Cap: Capacitor; Manufacturer_P/N: GCM21BR72A104KA37L; Digi-Key_Part_Number: 490-4789-1-ND; JLC P/N: C85866
D22 D26 D30 = Diode 1N4934: 1 Amp Fast Recovery Rectifier; Manufacturer_P/N: 1N4148WS; Digi-Key_Part_Number: 1N4148WSFSTR-ND; JLC P/N: C2128
D24 D28 D32 = LED_0805: Manufacturer_P/N: NCD0805R1; JLC P/N: C84256
Opto1 Opto3 Opto5 = PC817: Manufacturer_P/N: APC-817D1-SL; Digi-Key_Part_Number: 2007-APC-817D1-SLTR-ND; JLC P/N: C17448553
R128 R130 R134 R136 R140 R142 = Res1: Resistor; Manufacturer_P/N: RC0805FR-072K2L; Digi-Key_Part_Number: 311-2.20KCRTR-ND; JLC P/N: C114561
R132 R138 R144 = Res1: Resistor; Manufacturer_P/N: RC0805FR-071KL; Digi-Key_Part_Number: 311-1.00KCRTR-ND; JLC P/N: C95781

## Sheet Interface.SchDoc
size D; SheetNumber: 9; SheetTotal: 15
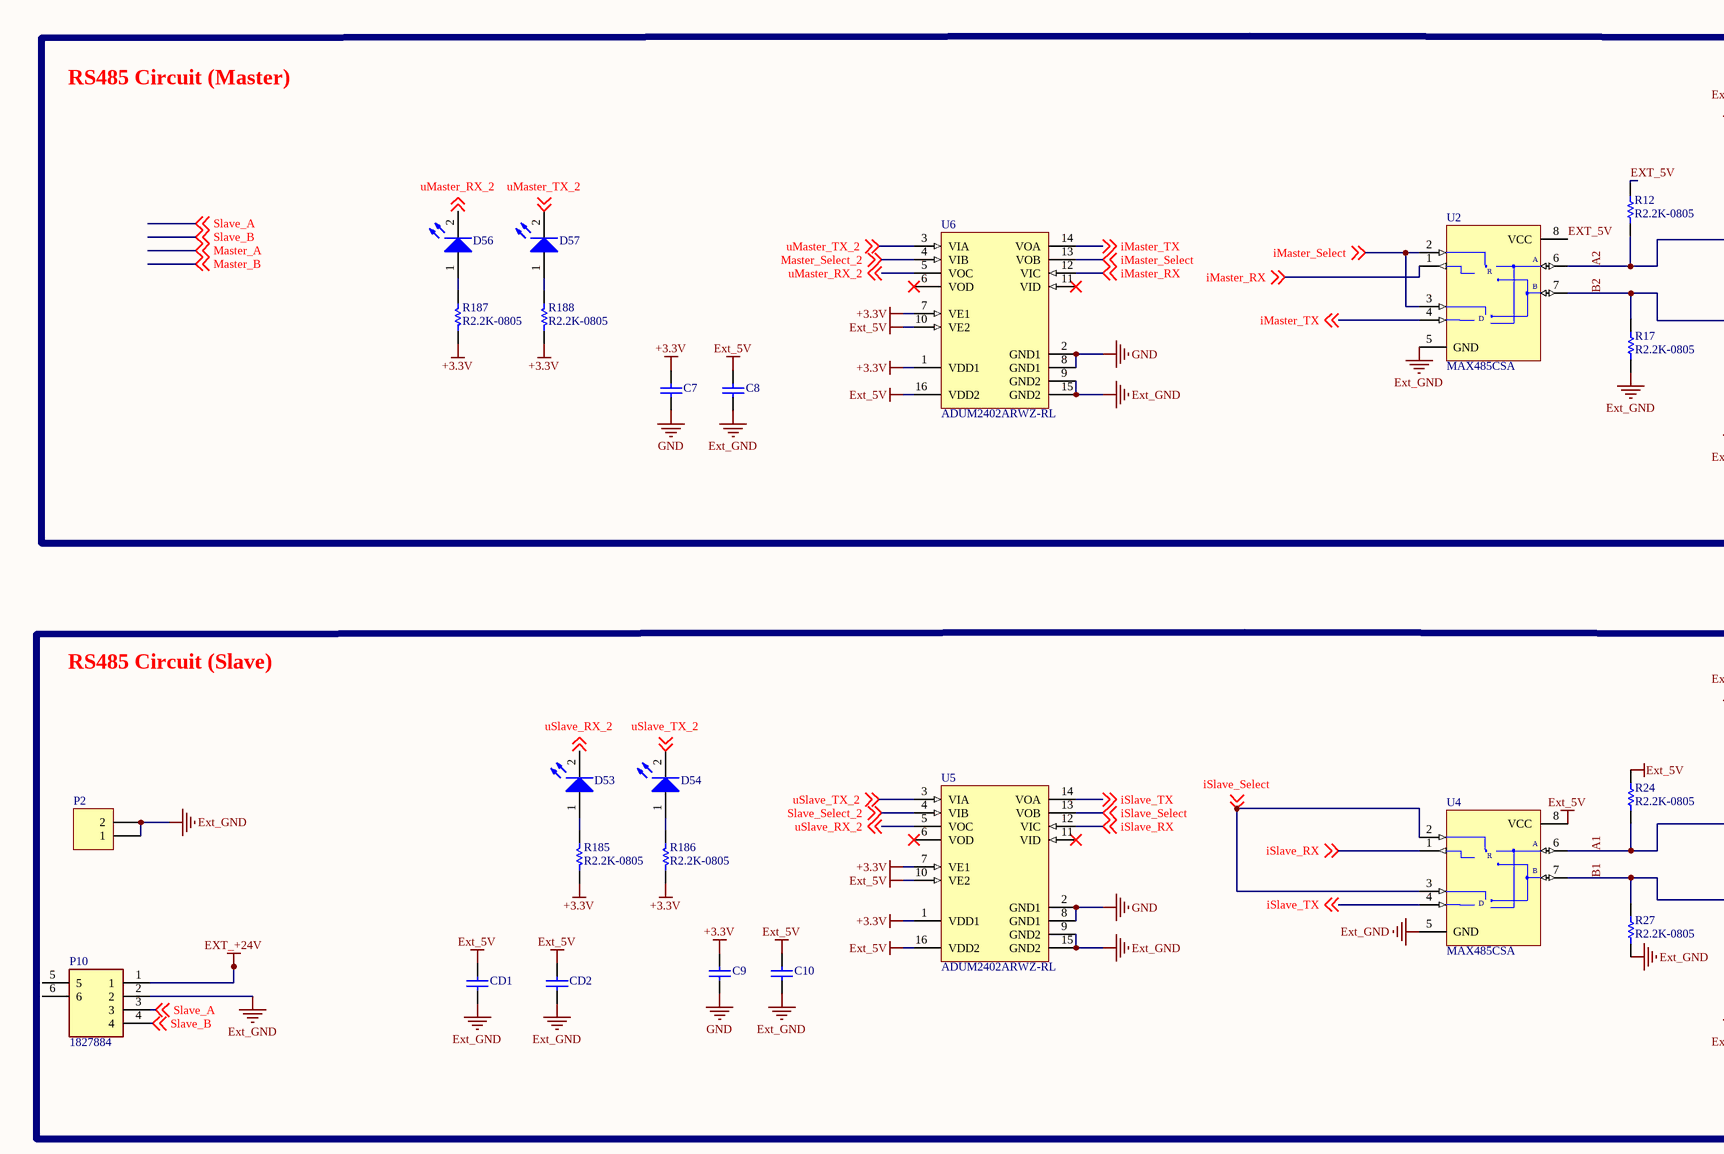
[diagram p10: Interface.SchDoc, top left]
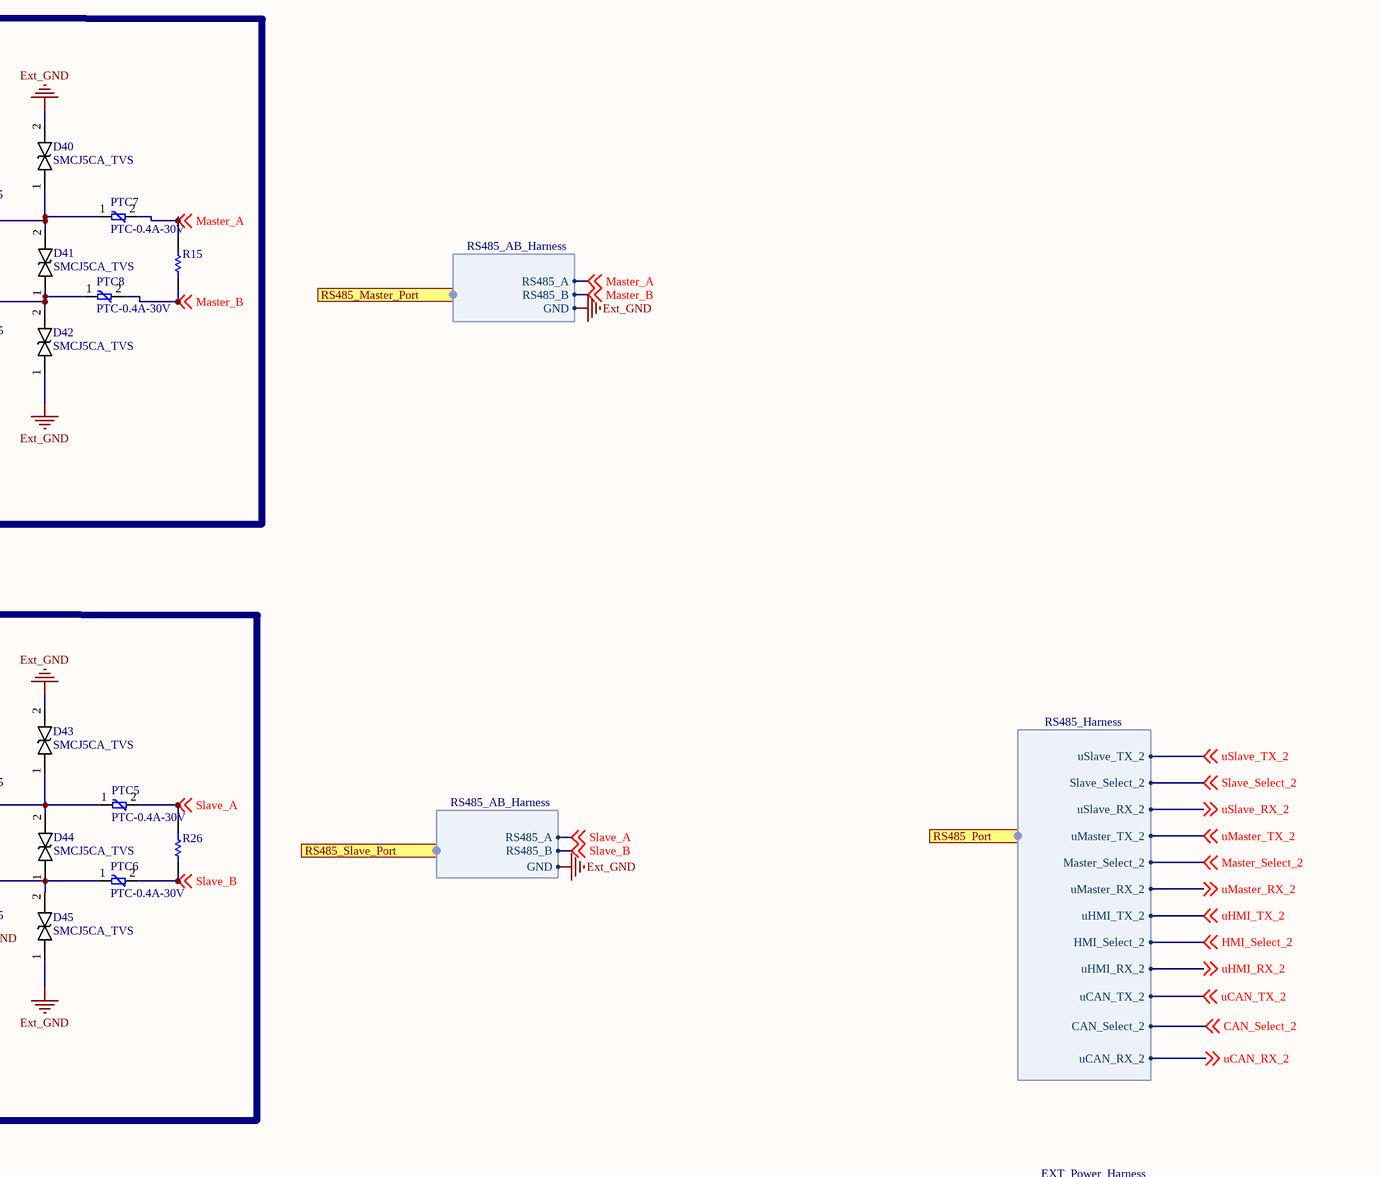
[diagram p11: Interface.SchDoc, top right]
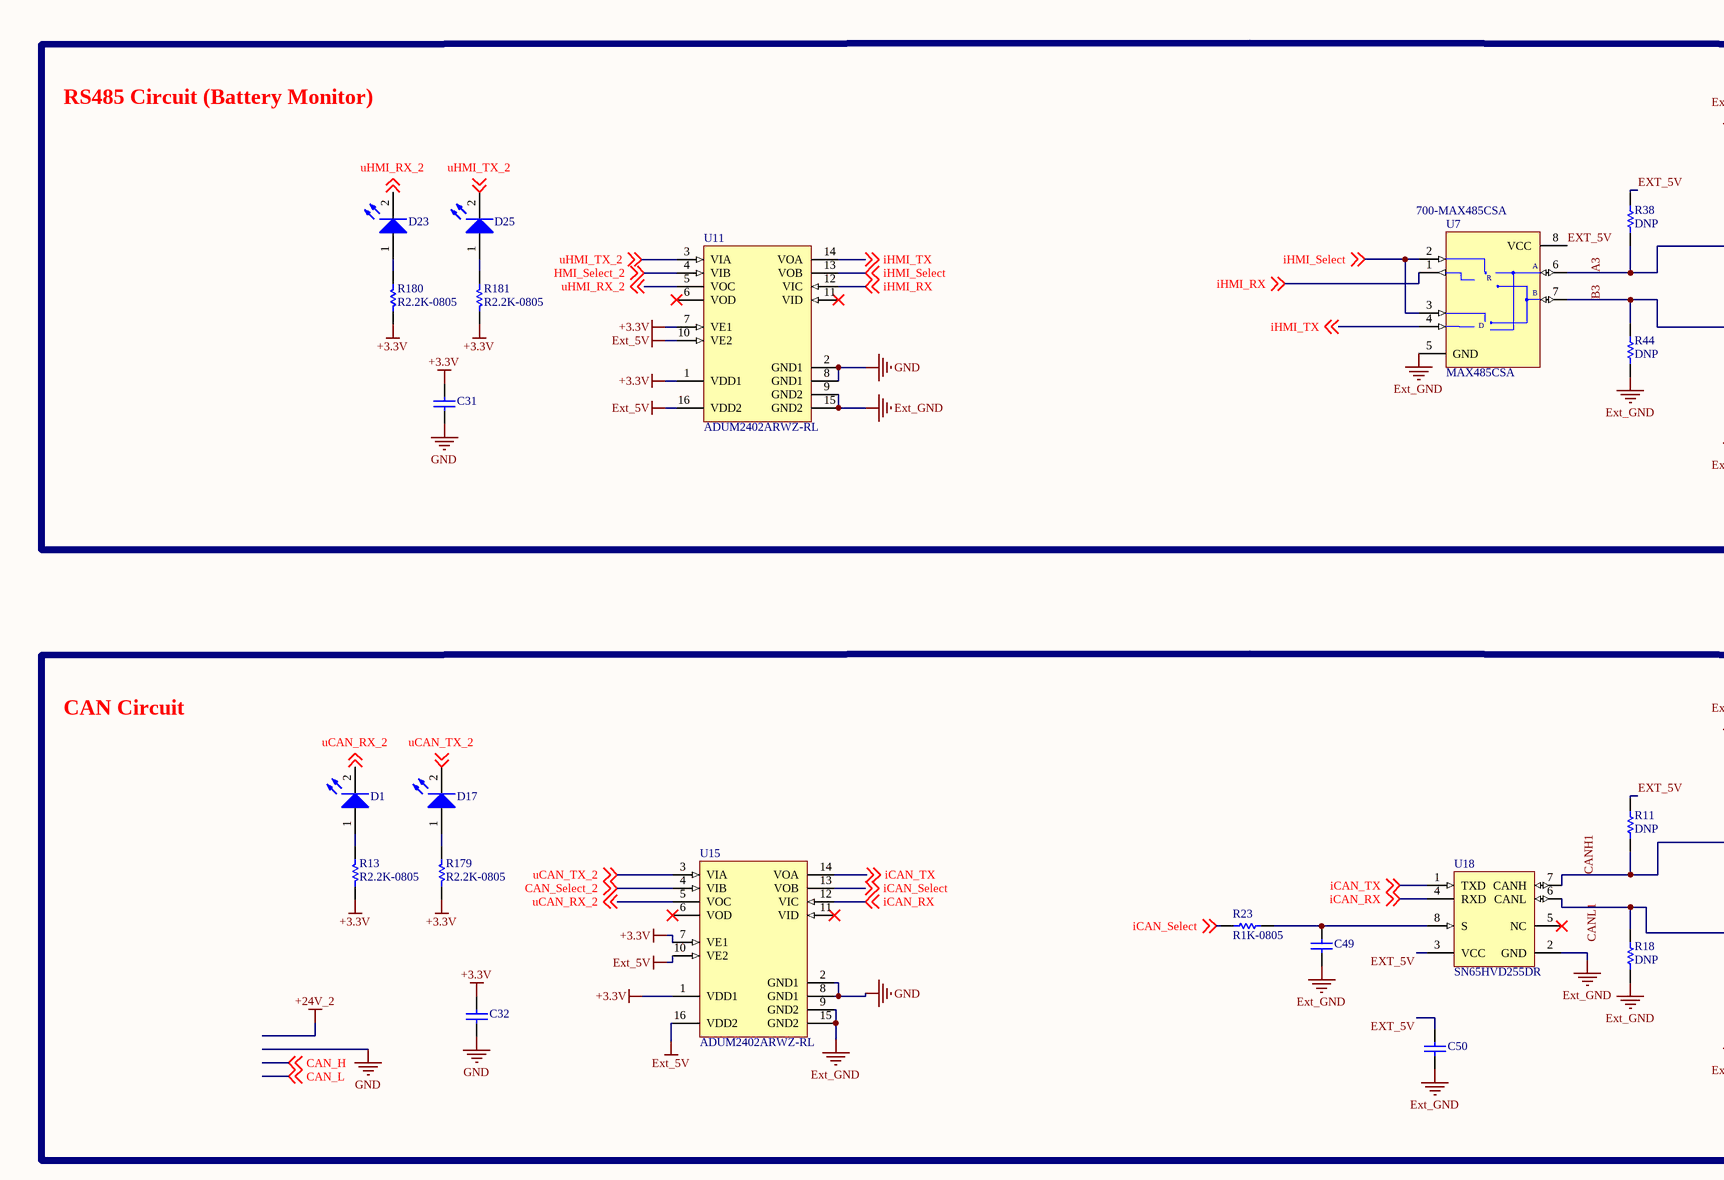
[diagram p12: Interface.SchDoc, bottom left]
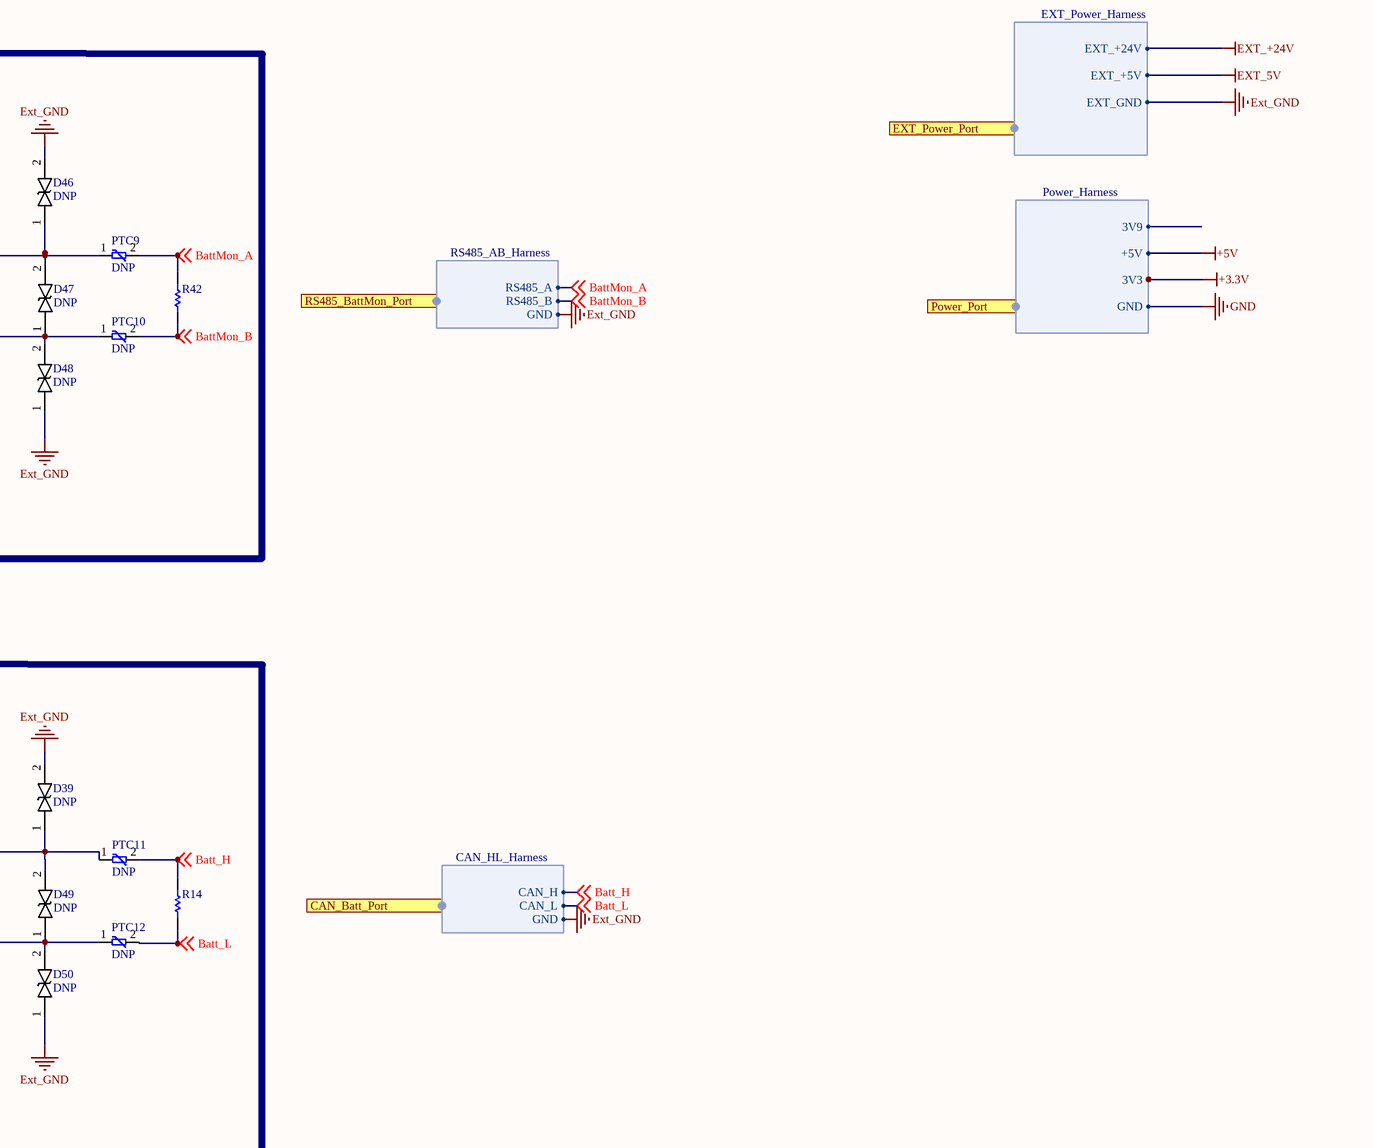
[diagram p13: Interface.SchDoc, bottom right]

### Parts
C7  (no value)  [CRF06031]
C8  (no value)  [CRF06031]
C9  (no value)  [CRF06031]
C10  (no value)  [CRF06031]
C31  (no value)  [CRF06031]
C32  (no value)  [CRF06031]
C49  (no value)  [CRF06031]
C50  (no value)  [CRF06031]
CD1  (no value)  [CRF06031]
CD2  (no value)  [CRF06031]
D1  LED_0805_green  [0805-LED]  (value not drawn)
D17  LED_0805_green  [0805-LED]  (value not drawn)
D23  LED_0805_green  [0805-LED]  (value not drawn)
D25  LED_0805_green  [0805-LED]  (value not drawn)
D39  DNP  [DO-214AC(SMA)]
D40  SMCJ5CA_TVS  [DO-214AC(SMA)]
D41  SMCJ5CA_TVS  [DO-214AC(SMA)]
D42  SMCJ5CA_TVS  [DO-214AC(SMA)]
D43  SMCJ5CA_TVS  [DO-214AC(SMA)]
D44  SMCJ5CA_TVS  [DO-214AC(SMA)]
D45  SMCJ5CA_TVS  [DO-214AC(SMA)]
D46  DNP  [DO-214AC(SMA)]
D47  DNP  [DO-214AC(SMA)]
D48  DNP  [DO-214AC(SMA)]
D49  DNP  [DO-214AC(SMA)]
D50  DNP  [DO-214AC(SMA)]
D53  LED_0805_green  [0805-LED]  (value not drawn)
D54  LED_0805_green  [0805-LED]  (value not drawn)
D56  LED_0805_green  [0805-LED]  (value not drawn)
D57  LED_0805_green  [0805-LED]  (value not drawn)
P2  DNP  [HDR1X2]  (value not drawn)
P10  1827884  [1827884]
PTC5  PTC-0.4A-30V  [CRF1206]
PTC6  PTC-0.4A-30V  [CRF1206]
PTC7  PTC-0.4A-30V  [CRF1206]
PTC8  PTC-0.4A-30V  [CRF1206]
PTC9  DNP  [CRF1206]
PTC10  DNP  [CRF1206]
PTC11  DNP  [CRF1206]
PTC12  DNP  [CRF1206]
R11  DNP  [CRF06031]
R12  R2.2K-0805  [CRF06031]
R13  R2.2K-0805  [CRF06031]
R14  DNP  [CRF06031]  (value not drawn)
R15  R2.2k-0805  [CRF06031]  (value not drawn)
R17  R2.2K-0805  [CRF06031]
R18  DNP  [CRF06031]
R23  R1K-0805  [CRF06031]
R24  R2.2K-0805  [CRF06031]
R26  R2.2k-0805  [CRF06031]  (value not drawn)
R27  R2.2K-0805  [CRF06031]
R38  DNP  [CRF06031]
R42  DNP  [CRF06031]  (value not drawn)
R44  DNP  [CRF06031]
R179  R2.2K-0805  [CRF06031]
R180  R2.2K-0805  [CRF06031]
R181  R2.2K-0805  [CRF06031]
R185  R2.2K-0805  [CRF06031]
R186  R2.2K-0805  [CRF06031]
R187  R2.2K-0805  [CRF06031]
R188  R2.2K-0805  [CRF06031]
U2  MAX485CSA  [SO8_N]
U4  MAX485CSA  [SO8_N]
U5  ADUM2402ARWZ-RL  [ADI-RW-16_L]
U6  ADUM2402ARWZ-RL  [ADI-RW-16_L]
U7  MAX485CSA  Supplier Part Number 1: 700-MAX485CSA  [SO8_N]
U11  ADUM2402ARWZ-RL  [ADI-RW-16_L]
U15  ADUM2402ARWZ-RL  [ADI-RW-16_L]
U18  SN65HVD255DR  [D0008A_L]

### Ports
CAN_Batt_Port (harness CAN_HL_Harness), EXT_Power_Port (harness EXT_Power_Harness), Power_Port (harness Power_Harness), RS485  Port (harness RS485_Harness), RS485_BattMon_Port (harness RS485_AB_Harness), RS485_Master_Port (harness RS485_AB_Harness), RS485_Slave_Port (harness RS485_AB_Harness)

### Harnesses
RS485_Harness: uSlave_TX_2, Slave_Select_2, uSlave_RX_2, uMaster_TX_2, Master_Select_2, uMaster_RX_2, uHMI_TX_2, HMI_Select_2, uHMI_RX_2, uCAN_TX_2, CAN_Select_2, uCAN_RX_2
Power_Harness: 3V9, +5V, 3V3, GND
EXT_Power_Harness: EXT_+24V, EXT_+5V, EXT_GND
RS485_AB_Harness: RS485_A, RS485_B, GND
CAN_HL_Harness: CAN_H, CAN_L, GND

### Nets
+3.3V: C7.2 C9.2 C31.2 C32.2 R13.2 R179.2 R180.2 R181.2 R185.2 R186.2 R187.2 R188.2 U5.1(VDD1) U5.7(VE1) U6.1(VDD1) U6.7(VE1) U11.1(VDD1) U11.7(VE1) U15.1(VDD1) U15.7(VE1) ; port Power_Port.3V3
EXT_5V: C8.2 C10.2 C50.2 CD1.2 CD2.2 R11.1 R12.1 R24.1 R38.1 U2.8(VCC) U4.8(VCC) U5.10(VE2) U5.16(VDD2) U6.10(VE2) U6.16(VDD2) U7.8(VCC) U11.10(VE2) U11.16(VDD2) U15.10(VE2) U15.16(VDD2) U18.3(VCC) ; port EXT_Power_Port.EXT_+5V
EXT_+24V: P10.1 ; port EXT_Power_Port.EXT_+24V
Ext_GND: C8.1 C10.1 C49.2 C50.1 CD1.1 CD2.1 D39.2(C) D40.2(C) D42.1(A) D43.2(C) D45.1(A) D46.2(C) D48.1(A) D50.1(A) P2.1 P2.2 P10.2 R17.2 R18.2 R27.2 R44.2 U2.5(GND) U4.5(GND) U5.9(GND2) U5.15(GND2) U6.9(GND2) U6.15(GND2) U7.5(GND) U11.9(GND2) U11.15(GND2) U15.9(GND2) U15.15(GND2) U18.2(GND) ; port EXT_Power_Port.EXT_GND, port RS485_Master_Port.GND, port RS485_Slave_Port.GND, port RS485_BattMon_Port.GND, port CAN_Batt_Port.GND
GND: C7.1 C9.1 C31.1 C32.1 U5.2(GND1) U5.8(GND1) U6.2(GND1) U6.8(GND1) U11.2(GND1) U11.8(GND1) U15.2(GND1) U15.8(GND1) ; port Power_Port.GND
A1: D43.1(A) D44.2(C) PTC5.1 R24.2 U4.6(A)
A2: D40.1(A) D41.2(C) PTC7.1 R12.2 U2.6(A)
A3: D46.1(A) D47.2(C) PTC9.1 R38.2 U7.6(A)
B1: D44.1(A) D45.2(C) PTC6.1 R27.1 U4.7(B)
B2: D41.1(A) D42.2(C) PTC8.1 R17.1 U2.7(B)
B3: D47.1(A) D48.2(C) PTC10.1 R44.1 U7.7(B)
Batt_H: PTC11.2 R14.1 ; off-sheet Batt_H, port CAN_Batt_Port.CAN_H
Batt_L: PTC12.2 R14.2 ; off-sheet Batt_L, port CAN_Batt_Port.CAN_L
BattMon_A: PTC9.2 R42.1 ; off-sheet BattMon_A, port RS485_BattMon_Port.RS485_A
BattMon_B: PTC10.2 R42.2 ; off-sheet BattMon_B, port RS485_BattMon_Port.RS485_B
CAN_Select_2: U15.4(VIB) ; off-sheet CAN_Select_2, port RS485  Port.CAN_Select_2
CANH1: D39.1(A) D49.2(C) PTC11.1 R11.2 U18.7(CANH)
HMI_Select_2: U11.4(VIB) ; off-sheet HMI_Select_2, port RS485  Port.HMI_Select_2
iCAN_RX: U15.12(VIC) U18.4(RXD) ; off-sheet iCAN_RX
iCAN_Select: R23.1 U15.13(VOB) ; off-sheet iCAN_Select
iCAN_TX: U15.14(VOA) U18.1(TXD) ; off-sheet iCAN_TX
iHMI_RX: U7.1(RO) U11.12(VIC) ; off-sheet iHMI_RX
iHMI_Select: U7.2(~{RE}) U7.3(DE) U11.13(VOB) ; off-sheet iHMI_Select
iHMI_TX: U7.4(DI) U11.14(VOA) ; off-sheet iHMI_TX
iMaster_RX: U2.1(RO) U6.12(VIC) ; off-sheet iMaster_RX
iMaster_Select: U2.2(~{RE}) U2.3(DE) U6.13(VOB) ; off-sheet iMaster_Select
iMaster_TX: U2.4(DI) U6.14(VOA) ; off-sheet iMaster_TX
iSlave_RX: U4.1(RO) U5.12(VIC) ; off-sheet iSlave_RX
iSlave_Select: U4.2(~{RE}) U4.3(DE) U5.13(VOB) ; off-sheet iSlave_Select
iSlave_TX: U4.4(DI) U5.14(VOA) ; off-sheet iSlave_TX
Master_A: PTC7.2 R15.1 ; off-sheet Master_A, port RS485_Master_Port.RS485_A
Master_B: PTC8.2 R15.2 ; off-sheet Master_B, port RS485_Master_Port.RS485_B
Master_Select_2: U6.4(VIB) ; off-sheet Master_Select_2, port RS485  Port.Master_Select_2
Slave_A: P10.3 PTC5.2 R26.1 ; off-sheet Slave_A, port RS485_Slave_Port.RS485_A
Slave_B: P10.4 PTC6.2 R26.2 ; off-sheet Slave_B, port RS485_Slave_Port.RS485_B
Slave_Select_2: U5.4(VIB) ; off-sheet Slave_Select_2, port RS485  Port.Slave_Select_2
uCAN_RX_2: D1.2(K) U15.5(VOC) ; off-sheet uCAN_RX_2, port RS485  Port.uCAN_RX_2
uCAN_TX_2: D17.2(K) U15.3(VIA) ; off-sheet uCAN_TX_2, port RS485  Port.uCAN_TX_2
uHMI_RX_2: D23.2(K) U11.5(VOC) ; off-sheet uHMI_RX_2, port RS485  Port.uHMI_RX_2
uHMI_TX_2: D25.2(K) U11.3(VIA) ; off-sheet uHMI_TX_2, port RS485  Port.uHMI_TX_2
uMaster_RX_2: D56.2(K) U6.5(VOC) ; off-sheet uMaster_RX_2, port RS485  Port.uMaster_RX_2
uMaster_TX_2: D57.2(K) U6.3(VIA) ; off-sheet uMaster_TX_2, port RS485  Port.uMaster_TX_2
uSlave_RX_2: D53.2(K) U5.5(VOC) ; off-sheet uSlave_RX_2, port RS485  Port.uSlave_RX_2
uSlave_TX_2: D54.2(K) U5.3(VIA) ; off-sheet uSlave_TX_2, port RS485  Port.uSlave_TX_2
NetC49_1: C49.1 R23.2 U18.8(S)
NetD1_1: D1.1(A) R13.1
NetD17_1: D17.1(A) R179.1
NetD23_1: D23.1(A) R180.1
NetD25_1: D25.1(A) R181.1
NetD49_1: D49.1(A) D50.2(C) PTC12.1 R18.1 U18.6(CANL)
NetD53_1: D53.1(A) R185.1
NetD54_1: D54.1(A) R186.1
NetD56_1: D56.1(A) R187.1
NetD57_1: D57.1(A) R188.1

Not connected (* = marked no-connect by the designer): P10 5 6; U5 6(VOD)* 11(VID)*; U6 6(VOD)* 11(VID)*; U11 6(VOD)* 11(VID)*; U15 6(VOD)* 11(VID)*; U18 5(NC)*

### Notes on the sheet
- RS485 Circuit (Master)
- RS485 Circuit (Slave)
- RS485 Circuit (Battery Monitor)
- CAN Circuit
- Labels drawn without touching a wire or pin: CANL1
- (in symbol MAX485CSA) R; D

### Library data of the parts
C7-C10 C31 C32 C50 CD1 CD2 = Cap: as C113 on sheet DigitalInputs; Digi-Key_Part_Number: 490-4789-1-ND; JLC P/N: C85866
  C7 C8: ClassName: RS485_Master
  C9 C10: ClassName: RS485_Slave
  C31: ClassName: RS485_BatMonitor
  C32 C50: ClassName: CAN_Bat
C49 = Cap: Capacitor; Manufacturer_P/N: GRM2165C2A102JA01D; ClassName: CAN_Bat; Digi-Key_Part_Number: 490-6445-2-ND; JLC P/N: C162289
D1 D17 D23 D25 D53 D54 D56 D57 = LED_0805: Manufacturer_P/N: NCD0805R1; JLC P/N: C84256
  D1 D17: ClassName: CAN_Bat
D39-D50 = SMCJ36CA_TVS: Manufacturer_P/N: SMCJ15CA-TR; Digi-Key_Part_Number: 497-6518-2-ND; JLC P/N: C133650
  D39 D49 D50: ClassName: CAN_Bat
  D40-D42: ClassName: RS485_Master
  D43-D45: ClassName: RS485_Slave
  D46-D48: ClassName: RS485_BatMonitor
P2 = Header 2
P10 = 1827884: Connector; Manufacturer_Name: Phoenix Contact; Manufacturer_Part_Number: 1827884; Mouser Part Number: 651-1827884; Arrow Part Number: 1827884; Digi-Key_Part_Number: 277-5791-ND; Manufacturer_P/N: 1827884; JLC P/N: C480609
PTC5-PTC12 = PTC: Manufacturer_P/N: 0ZCJ0005FF2E; Digi-Key_Part_Number: 5923-0ZCJ0005FF2ETR-ND; JLC P/N: C194141
  PTC5 PTC6: ClassName: RS485_Slave
  PTC7 PTC8: ClassName: RS485_Master
  PTC9 PTC10: ClassName: RS485_BatMonitor
  PTC11 PTC12: ClassName: CAN_Bat
R11 R14 R18 R38 R42 R44 = Res1
  R11 R14 R18: ClassName: CAN_Bat
  R38 R42 R44: ClassName: RS485_BatMonitor
R12 R13 R17 R24 R27 R179-R181 R185-R188 = Res1: as R128 on sheet DigitalInputs; Digi-Key_Part_Number: 311-2.20KCRTR-ND; JLC P/N: C114561
  R12 R17: ClassName: RS485_Master
  R13 R179: ClassName: CAN_Bat
  R24 R27: ClassName: RS485_Slave
R15 R26 = Res1: DNP; Manufacturer_P/N: RC0805FR-072K2L; Digi-Key_Part_Number: 311-2.20KCRTR-ND; JLC P/N: C114561
  R15: ClassName: RS485_Master
  R26: ClassName: RS485_Slave
R23 = Res1: as R132 on sheet DigitalInputs; ClassName: CAN_Bat; Digi-Key_Part_Number: 311-1.00KCRTR-ND; JLC P/N: C95781
U2 U4 = MAX485CSA: SMD; Manufacturer_P/N: MAX485CSA+; Digi-Key_Part_Number: MAX485CSA+-ND; JLC P/N: C143494
  U2: ClassName: RS485_Master
  U4: ClassName: RS485_Slave
U5 U6 U11 U15 = CMP-0534-00427-1: Quad Channel Digital Isolator, 5 KV rms Insulation Rating, 1 Mbps Data Rate, 100 ns Delay, Industrial, 16-pin SOIC (RW-16), Reel; PartNumber: ADUM2402ARWZ-RL; Digi-Key_Part_Number: 505-ADUM2402ARWZ-RLTR-ND; Manufacturer_P/N: ADUM2402ARWZ-RL; JLC P/N: C406693
  U5: ClassName: RS485_Slave
  U6: ClassName: RS485_Master
  U11: ClassName: RS485_BatMonitor
  U15: ClassName: CAN_Bat
U7 = MAX485CSA: DNP; Manufacturer_P/N: MAX485CSA+; ClassName: RS485_BatMonitor; Digi-Key_Part_Number: MAX485CSA+-ND; Supplier 1: Mouser; JLC P/N: C143494
U18 = CMP-0315-00057-2: CAN Transceiver with Fast Loop Times for Highly Loaded Networks, 85 mA, 5 V, -40 to 125 degC, 8-pin SOIC (D), Green (RoHS & no Sb/Br); Footprint: TJA1051T, PCA82C251, TJA1050; PartNumber: SN65HVD255DR; ClassName: CAN_Bat; Digi-Key_Part_Number: 296-30092-2-ND; Manufacturer_P/N: SN65HVD255DR; JLC P/N: C132552

## Sheet Connector_Outside.SchDoc
size A; SheetNumber: 12; SheetTotal: 15
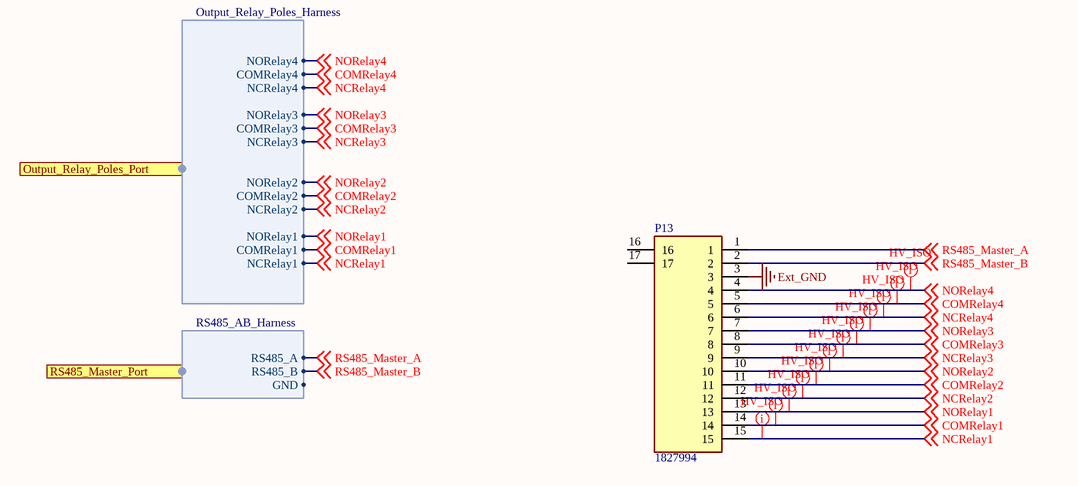
[diagram p14: Connector_Outside.SchDoc]

### Parts
P13  1827994  [1827994]

### Ports
Output_Relay_Poles_Port (harness Output_Relay_Poles_Harness), RS485_Master_Port (harness RS485_AB_Harness)

### Harnesses
Output_Relay_Poles_Harness: NCRelay1, NCRelay2, NCRelay3, NCRelay4, COMRelay1, COMRelay2, COMRelay3, COMRelay4, NORelay1, NORelay2, NORelay3, NORelay4
RS485_AB_Harness: RS485_A, RS485_B, GND

### Nets
Ext_GND: P13.3 ; port RS485_Master_Port.GND
COMRelay1: P13.14 ; off-sheet COMRelay1, port Output_Relay_Poles_Port.COMRelay1
COMRelay2: P13.11 ; off-sheet COMRelay2, port Output_Relay_Poles_Port.COMRelay2
COMRelay3: P13.8 ; off-sheet COMRelay3, port Output_Relay_Poles_Port.COMRelay3
COMRelay4: P13.5 ; off-sheet COMRelay4, port Output_Relay_Poles_Port.COMRelay4
NCRelay1: P13.15 ; off-sheet NCRelay1, port Output_Relay_Poles_Port.NCRelay1
NCRelay2: P13.12 ; off-sheet NCRelay2, port Output_Relay_Poles_Port.NCRelay2
NCRelay3: P13.9 ; off-sheet NCRelay3, port Output_Relay_Poles_Port.NCRelay3
NCRelay4: P13.6 ; off-sheet NCRelay4, port Output_Relay_Poles_Port.NCRelay4
NORelay1: P13.13 ; off-sheet NORelay1, port Output_Relay_Poles_Port.NORelay1
NORelay2: P13.10 ; off-sheet NORelay2, port Output_Relay_Poles_Port.NORelay2
NORelay3: P13.7 ; off-sheet NORelay3, port Output_Relay_Poles_Port.NORelay3
NORelay4: P13.4 ; off-sheet NORelay4, port Output_Relay_Poles_Port.NORelay4
RS485_Master_A: P13.1 ; off-sheet RS485_Master_A, port RS485_Master_Port.RS485_A  [project net Master_A]
RS485_Master_B: P13.2 ; off-sheet RS485_Master_B, port RS485_Master_Port.RS485_B  [project net Master_B]

Not connected (* = marked no-connect by the designer): P13 16 17

### Layout directives
net class HV_ISO: COMRelay1, COMRelay2, COMRelay3, COMRelay4, NCRelay1, NCRelay2, NCRelay3, NCRelay4, NORelay1, NORelay2, NORelay3, NORelay4

### Library data of the parts
P13 = 1827994: Connector; Manufacturer_Name: Phoenix Contact; Manufacturer_Part_Number: 1827994; Mouser Part Number: 651-1827994; Digi-Key_Part_Number: 277-6415-ND; Manufacturer_P/N: 1827994; JLC P/N: C6655796

## Sheet Connector_Battery.SchDoc
size A; SheetNumber: 10; SheetTotal: 15
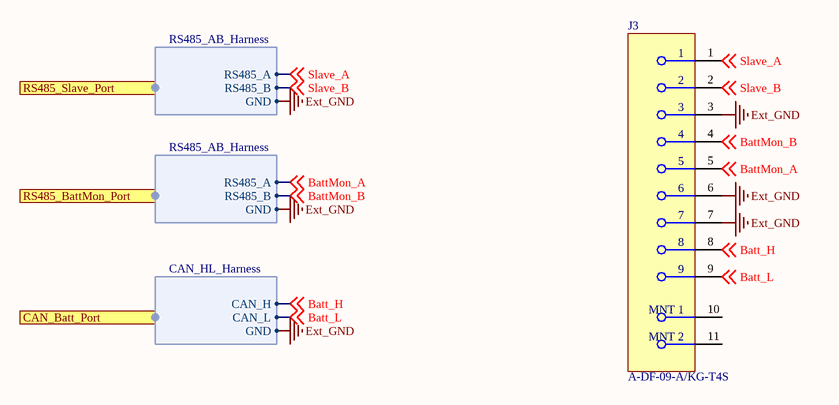
[diagram p15: Connector_Battery.SchDoc]

### Parts
J3  A-DF-09-A/KG-T4S  [FP-A-DF_09_A-KG-T4S-MFG]

### Ports
CAN_Batt_Port (harness CAN_HL_Harness), RS485_BattMon_Port (harness RS485_AB_Harness), RS485_Slave_Port (harness RS485_AB_Harness)

### Harnesses
RS485_AB_Harness: RS485_A, RS485_B, GND
CAN_HL_Harness: CAN_H, CAN_L, GND

### Nets
Ext_GND: J3.3 J3.6 J3.7 ; port RS485_Slave_Port.GND, port RS485_BattMon_Port.GND, port CAN_Batt_Port.GND
Batt_H: J3.8 ; off-sheet Batt_H, port CAN_Batt_Port.CAN_H
Batt_L: J3.9 ; off-sheet Batt_L, port CAN_Batt_Port.CAN_L
BattMon_A: J3.5 ; off-sheet BattMon_A, port RS485_BattMon_Port.RS485_A
BattMon_B: J3.4 ; off-sheet BattMon_B, port RS485_BattMon_Port.RS485_B
Slave_A: J3.1 ; off-sheet Slave_A, port RS485_Slave_Port.RS485_A
Slave_B: J3.2 ; off-sheet Slave_B, port RS485_Slave_Port.RS485_B

Not connected (* = marked no-connect by the designer): J3 10(MNT_1) 11(MNT_2)

### Library data of the parts
J3 = CMP-10493-48660751-2: Conn D-Sub F 9 POS 1.38mm Solder RA Thru-Hole 9 Terminal 1 Port; Manufacturer_P/N: A-DF 09 A/KG-T4S; Min Operating Temperature: -55°C; Mount: Through Hole; Digi-Key_Part_Number: AE10924-ND; JLC P/N: C3140260

## Sheet Connector_Inverter.SchDoc
size A; SheetNumber: 11; SheetTotal: 15
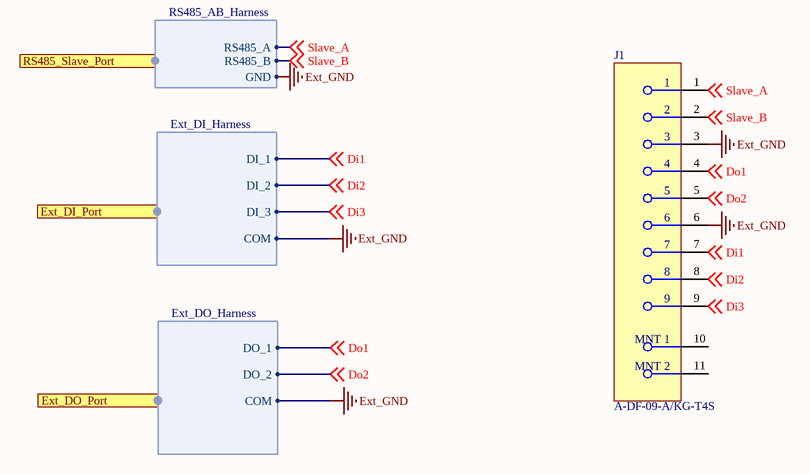
[diagram p16: Connector_Inverter.SchDoc]

### Parts
J1  A-DF-09-A/KG-T4S  [FP-A-DF_09_A-KG-T4S-MFG]

### Ports
Ext_DI_Port (harness Ext_DI_Harness), Ext_DO_Port (harness Ext_DO_Harness), RS485_Slave_Port (harness RS485_AB_Harness)

### Harnesses
RS485_AB_Harness: RS485_A, RS485_B, GND
Ext_DI_Harness: DI_1, DI_2, DI_3, COM
Ext_DO_Harness: DO_1, DO_2, COM

### Nets
Ext_GND: J1.3 J1.6 ; port RS485_Slave_Port.GND, port Ext_DI_Port.COM, port Ext_DO_Port.COM
Di1: J1.7 ; off-sheet Di1, port Ext_DI_Port.DI_1
Di2: J1.8 ; off-sheet Di2, port Ext_DI_Port.DI_2
Di3: J1.9 ; off-sheet Di3, port Ext_DI_Port.DI_3
Do1: J1.4 ; off-sheet Do1, port Ext_DO_Port.DO_1
Do2: J1.5 ; off-sheet Do2, port Ext_DO_Port.DO_2
Slave_A: J1.1 ; off-sheet Slave_A, port RS485_Slave_Port.RS485_A
Slave_B: J1.2 ; off-sheet Slave_B, port RS485_Slave_Port.RS485_B

Not connected (* = marked no-connect by the designer): J1 10(MNT_1) 11(MNT_2)

### Library data of the parts
J1 = CMP-10493-48660751-2: as J3 on sheet Connector_Battery; Min Operating Temperature: -55°C; Mount: Through Hole; Digi-Key_Part_Number: AE10924-ND; JLC P/N: C3140260

## Sheet RGB_LED.SchDoc
size A; SheetNumber: 13; SheetTotal: 15
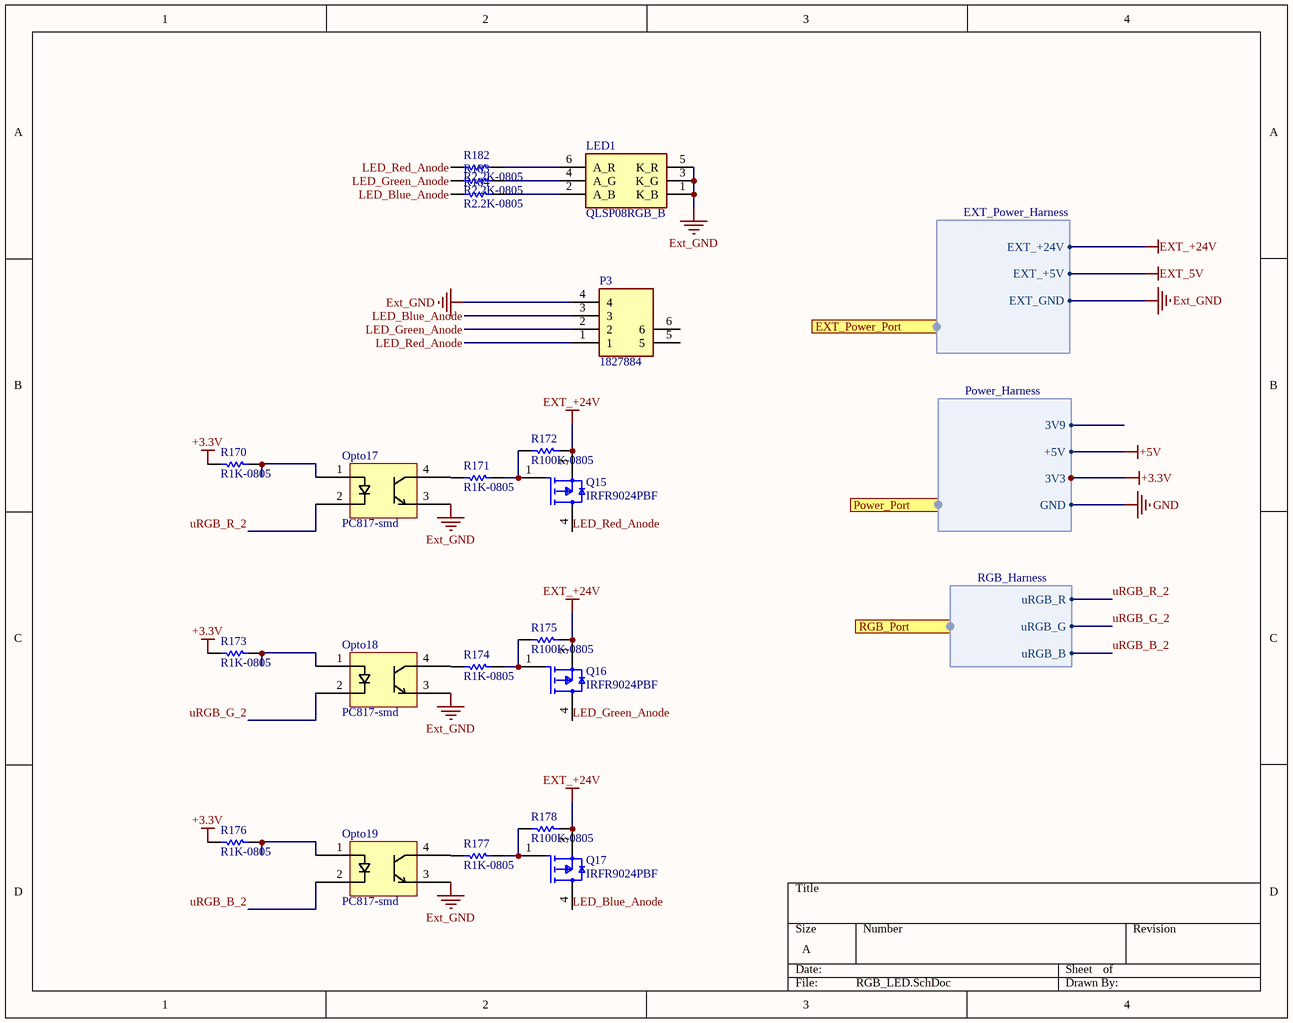
[diagram p17: RGB_LED.SchDoc]

### Parts
LED1  QLSP08RGB_B  [QLSP08RGB_B]
Opto17  PC817-smd  [PC817_SMD1]
Opto18  PC817-smd  [PC817_SMD1]
Opto19  PC817-smd  [PC817_SMD1]
P3  1827884  [1827884]
Q15  IRFR9024PBF  [FP-E22-0399-N-MFG]
Q16  IRFR9024PBF  [FP-E22-0399-N-MFG]
Q17  IRFR9024PBF  [FP-E22-0399-N-MFG]
R170  R1K-0805  [CRF06031]
R171  R1K-0805  [CRF06031]
R172  R100K-0805  [CRF06031]
R173  R1K-0805  [CRF06031]
R174  R1K-0805  [CRF06031]
R175  R100K-0805  [CRF06031]
R176  R1K-0805  [CRF06031]
R177  R1K-0805  [CRF06031]
R178  R100K-0805  [CRF06031]
R182  R2.2K-0805  [CRF06031]
R183  R2.2K-0805  [CRF06031]
R184  R2.2K-0805  [CRF06031]

### Ports
EXT_Power_Port (harness EXT_Power_Harness), Power_Port (harness Power_Harness), RGB_Port (harness RGB_Harness)

### Harnesses
Power_Harness: 3V9, +5V, 3V3, GND
EXT_Power_Harness: EXT_+24V, EXT_+5V, EXT_GND
RGB_Harness: uRGB_R, uRGB_G, uRGB_B

### Nets
+3.3V: R170.2 R173.2 R176.2 ; port Power_Port.3V3
EXT_+24V: Q15.3(S) Q16.3(S) Q17.3(S) R172.2 R175.2 R178.2 ; port EXT_Power_Port.EXT_+24V
Ext_GND: LED1.1(K_B) LED1.3(K_G) LED1.5(K_R) Opto17.3 Opto18.3 Opto19.3 P3.4 ; port EXT_Power_Port.EXT_GND
LED_Blue_Anode: P3.3 Q17.4(D) R184.1
LED_Green_Anode: P3.2 Q16.4(D) R183.1
LED_Red_Anode: P3.1 Q15.4(D) R182.1
uRGB_B_2: Opto19.2 ; port RGB_Port.uRGB_B
uRGB_G_2: Opto18.2 ; port RGB_Port.uRGB_G
uRGB_R_2: Opto17.2 ; port RGB_Port.uRGB_R
NetLED1_2: LED1.2(A_B) R184.2
NetLED1_4: LED1.4(A_G) R183.2
NetLED1_6: LED1.6(A_R) R182.2
NetOpto17_1: Opto17.1 R170.1
NetOpto17_4: Opto17.4 R171.2
NetOpto18_1: Opto18.1 R173.1
NetOpto18_4: Opto18.4 R174.2
NetOpto19_1: Opto19.1 R176.1
NetOpto19_4: Opto19.4 R177.2
NetQ15_1: Q15.1(G) R171.1 R172.1
NetQ16_1: Q16.1(G) R174.1 R175.1
NetQ17_1: Q17.1(G) R177.1 R178.1

Not connected (* = marked no-connect by the designer): P3 5 6

### Library data of the parts
LED1 = QLSP08RGB_B: LED; Manufacturer_Name: QUELIGHTING; Manufacturer_Part_Number: QLSP08RGB_B; Digi-Key_Part_Number: 3970-QLSP08RGB_BTR-ND; Manufacturer_P/N: QLSP08RGB_B; JLC P/N: C6629975
Opto17-Opto19 = PC817: Manufacturer_P/N: APC-817D1-SL; Digi-Key_Part_Number: 2007-APC-817D1-SLTR-ND; JLC P/N: C17448553
P3 = 1827884: as P10 on sheet Interface; Manufacturer_Part_Number: 1827884; Mouser Part Number: 651-1827884; Arrow Part Number: 1827884; Digi-Key_Part_Number: 277-5791-ND; Manufacturer_P/N: 1827884; JLC P/N: C480609
Q15-Q17 = CMP-02550-000303-1: MOSFET P-CH 60V 8.8A DPAK; Mount: Surface Mount; Min Operating Temperature: -55°C; Digi-Key_Part_Number: IRFR9024PBF-ND; Manufacturer_P/N: IRFR9024PBF; JLC P/N: C727805
R170 R171 R173 R174 R176 R177 = Res1: as R132 on sheet DigitalInputs; Digi-Key_Part_Number: 311-1.00KCRTR-ND; JLC P/N: C95781
R172 R175 R178 = Res1: Resistor; Manufacturer_P/N: RC0805FR-07100KL; Digi-Key_Part_Number: 311-100KCRTR-ND; JLC P/N: C96346
R182-R184 = Res1: as R128 on sheet DigitalInputs; Digi-Key_Part_Number: 311-2.20KCRTR-ND; JLC P/N: C114561

## Sheet SMUTop.SchDoc
size A; SheetNumber: 9; SheetTotal: 11
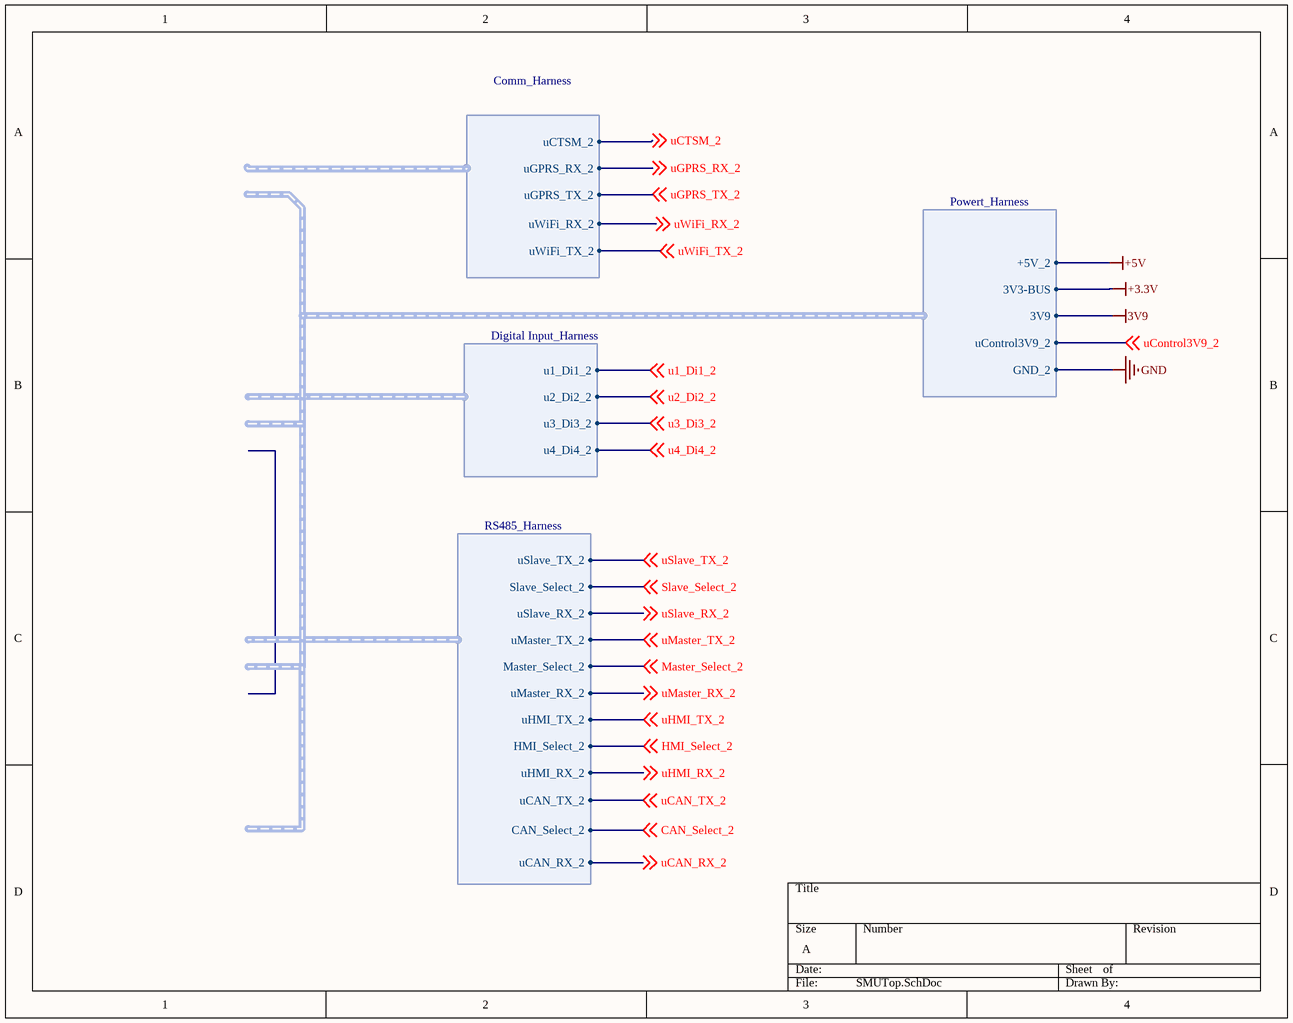
[diagram p18: SMUTop.SchDoc]

### Harnesses
Digital Input_Harness: u1_Di1_2, u2_Di2_2, u3_Di3_2, u4_Di4_2
Powert_Harness: +5V_2, 3V3-BUS, 3V9, uControl3V9_2, GND_2
RS485_Harness: uSlave_TX_2, Slave_Select_2, uSlave_RX_2, uMaster_TX_2, Master_Select_2, uMaster_RX_2, uHMI_TX_2, HMI_Select_2, uHMI_RX_2, uCAN_TX_2, CAN_Select_2, uCAN_RX_2
Comm_Harness: uCTSM_2, uGPRS_RX_2, uGPRS_TX_2, uWiFi_TX_2, uWiFi_RX_2

### Nets
CAN_Select_2: off-sheet CAN_Select_2, harness RS485_Harness.CAN_Select_2
HMI_Select_2: off-sheet HMI_Select_2, harness RS485_Harness.HMI_Select_2
Master_Select_2: off-sheet Master_Select_2, harness RS485_Harness.Master_Select_2
Slave_Select_2: off-sheet Slave_Select_2, harness RS485_Harness.Slave_Select_2
u1_Di1_2: off-sheet u1_Di1_2, harness Digital Input_Harness.u1_Di1_2
u2_Di2_2: off-sheet u2_Di2_2, harness Digital Input_Harness.u2_Di2_2
u3_Di3_2: off-sheet u3_Di3_2, harness Digital Input_Harness.u3_Di3_2
u4_Di4_2: off-sheet u4_Di4_2, harness Digital Input_Harness.u4_Di4_2
uCAN_RX_2: off-sheet uCAN_RX_2, harness RS485_Harness.uCAN_RX_2
uCAN_TX_2: off-sheet uCAN_TX_2, harness RS485_Harness.uCAN_TX_2
uControl3V9_2: off-sheet uControl3V9_2, harness Powert_Harness.uControl3V9_2
uCTSM_2: off-sheet uCTSM_2, harness Comm_Harness.uCTSM_2
uGPRS_RX_2: off-sheet uGPRS_RX_2, harness Comm_Harness.uGPRS_RX_2
uGPRS_TX_2: off-sheet uGPRS_TX_2, harness Comm_Harness.uGPRS_TX_2
uHMI_RX_2: off-sheet uHMI_RX_2, harness RS485_Harness.uHMI_RX_2
uHMI_TX_2: off-sheet uHMI_TX_2, harness RS485_Harness.uHMI_TX_2
uMaster_RX_2: off-sheet uMaster_RX_2, harness RS485_Harness.uMaster_RX_2
uMaster_TX_2: off-sheet uMaster_TX_2, harness RS485_Harness.uMaster_TX_2
uSlave_RX_2: off-sheet uSlave_RX_2, harness RS485_Harness.uSlave_RX_2
uSlave_TX_2: off-sheet uSlave_TX_2, harness RS485_Harness.uSlave_TX_2
uWiFi_RX_2: off-sheet uWiFi_RX_2, harness Comm_Harness.uWiFi_RX_2
uWiFi_TX_2: off-sheet uWiFi_TX_2, harness Comm_Harness.uWiFi_TX_2

## Sheet PowerTop.SchDoc
size A3; SheetNumber: 11; SheetTotal: 11

## Nets that join several sheets
3V9: Power (9 pins), Comm (12 pins)
+3.3V: Memory (10 pins), Power (11 pins), SSR (R149.1 R150.1 R151.2 R152.2), MCU (C24.2 ds18b20.3 R146.2), Relay (8 pins), Comm (7 pins), DigitalInputs (6 pins), Interface (20 pins), RGB_LED (R170.2 R173.2 R176.2)
+5V: Memory (FB10.2), Power (18 pins), MCU (J4.13 J4.14)
EXT_5V: Power (5 pins), Relay (24 pins), Interface (21 pins)
EXT_+24V: Power (9 pins), Relay (8 pins), Interface (P10.1), RGB_LED (6 pins)
Ext_GND: Power (19 pins), SSR (Opto6.3 Opto7.3), Relay (18 pins), DigitalInputs (9 pins), Interface (33 pins), Connector_Outside (P13.3), Connector_Battery (J3.3 J3.6 J3.7), Connector_Inverter (J1.3 J1.6), RGB_LED (7 pins)
GND: Memory (10 pins), Power (41 pins), MCU (49 pins), Comm (79 pins), DigitalInputs (Opto1.3 Opto3.3 Opto5.3), Interface (12 pins)
uControl3.9_2: Power (R103.1), MCU (R31.2)
VDD_MCU: Power (L3.2), MCU (32 pins)
VDDA: Power (C29.1 C30.1 L2.2), MCU (C85.1 C86.1 U17.22)
B_Do1: SSR (C119.1 D35.1 D37.2 Opto6.2), MCU (R72.2)
B_Do2: SSR (C118.1 D34.1 D36.2 Opto7.2), MCU (R95.2)
Batt_H: Interface (PTC11.2 R14.1), Connector_Battery (J3.8)
Batt_L: Interface (PTC12.2 R14.2), Connector_Battery (J3.9)
BattMon_A: Interface (PTC9.2 R42.1), Connector_Battery (J3.5)
BattMon_B: Interface (PTC10.2 R42.2), Connector_Battery (J3.4)
CAN_Select_2: MCU (R30.1), Interface (U15.4)
COMRelay1: Relay (K1.5), Connector_Outside (P13.14)
COMRelay2: Relay (K2.5), Connector_Outside (P13.11)
COMRelay3: Relay (K3.5), Connector_Outside (P13.8)
COMRelay4: Relay (K4.5), Connector_Outside (P13.5)
Di1: DigitalInputs (R130.1), Connector_Inverter (J1.7)
Di2: DigitalInputs (R136.1), Connector_Inverter (J1.8)
Di3: DigitalInputs (R142.1), Connector_Inverter (J1.9)
Do1: SSR (Opto6.4), Connector_Inverter (J1.4)
Do2: SSR (Opto7.4), Connector_Inverter (J1.5)
HMI_Select_2: MCU (R29.2), Interface (U11.4)
Master_A: Interface (PTC7.2 R15.1), Connector_Outside (P13.1)
Master_B: Interface (PTC8.2 R15.2), Connector_Outside (P13.2)
Master_Select_2: MCU (R50.2), Interface (U6.4)
NCRelay1: Relay (K1.3), Connector_Outside (P13.15)
NCRelay2: Relay (K2.3), Connector_Outside (P13.12)
NCRelay3: Relay (K3.3), Connector_Outside (P13.9)
NCRelay4: Relay (K4.3), Connector_Outside (P13.6)
NORelay1: Relay (K1.2), Connector_Outside (P13.13)
NORelay2: Relay (K2.2), Connector_Outside (P13.10)
NORelay3: Relay (K3.2), Connector_Outside (P13.7)
NORelay4: Relay (K4.2), Connector_Outside (P13.4)
SCL: Memory (R1.2 U1.6), MCU (R113.2)
SD_Detect_2: Memory (CN1.9 R10.1), MCU (R112.2)
SDA: Memory (R3.2 U1.5), MCU (R114.2)
SDIO_CMD_2: Memory (CN1.3 R6.2), MCU (R97.2)
SDIO_D0_2: Memory (CN1.7 R5.2), MCU (R99.2)
SDIO_D1_2: Memory (CN1.8 R4.2), MCU (R110.2)
SDIO_D2_2: Memory (CN1.1 R8.2), MCU (R16.2)
SDIO_D3_2: Memory (CN1.2 R7.2), MCU (R96.2)
SDIO_SCK_2: Memory (CN1.5), MCU (R98.2)
Slave_A: Interface (P10.3 PTC5.2 R26.1), Connector_Battery (J3.1), Connector_Inverter (J1.1)
Slave_B: Interface (P10.4 PTC6.2 R26.2), Connector_Battery (J3.2), Connector_Inverter (J1.2)
Slave_Select_2: MCU (R53.2), Interface (U5.4)
u1_Di1_2: MCU (R78.2), DigitalInputs (D24.2 Opto1.4 R128.2)
u2_Di2_2: MCU (R76.2), DigitalInputs (D28.2 Opto3.4 R134.2)
u3_Di3_2: MCU (R74.2), DigitalInputs (D32.2 Opto5.4 R140.2)
u_BAT_CUT_N_2: Power (R66.1), MCU (R148.2)
u_BAT_CUT_P_2: Power (Opto16.1), MCU (R147.2)
u_Relay1_2: MCU (R19.2), Relay (C116.1 Opto4.2)
u_Relay2_2: MCU (R20.2), Relay (C120.1 Opto8.2)
u_Relay3_2: MCU (R21.2), Relay (C121.1 Opto9.2)
u_Relay4_2: MCU (R22.2), Relay (C122.1 Opto10.2)
u_Relay5_2: MCU (R41.2), Relay (C123.1 Opto11.2)
u_RelayGEN_2: MCU (R153.2), Relay (C18.1 Opto12.2)
u_RelayGenHeat_2: MCU (R157.2), Relay (C22.1 Opto15.2)
u_RelayGRID_N_2: MCU (R155.2), Relay (C19.1 Opto13.2)
u_RelayGRID_P_2: MCU (R154.2), Relay (R127.2)
u_RelayLOAD_2: MCU (R156.2), Relay (C20.1 Opto14.2)
uCAN_RX_2: MCU (R115.1), Interface (D1.2 U15.5)
uCAN_TX_2: MCU (R33.1), Interface (D17.2 U15.3)
uCTSM_2: MCU (R80.2), Comm (U14.20)
uGPRS_RX_2: MCU (R56.2), Comm (U14.17)
uGPRS_TX_2: MCU (R58.2), Comm (U14.18)
uHMI_RX_2: MCU (R160.2), Interface (D23.2 U11.5)
uHMI_TX_2: MCU (R162.2), Interface (D25.2 U11.3)
uMaster_RX_2: MCU (R54.2), Interface (D56.2 U6.5)
uMaster_TX_2: MCU (R52.2), Interface (D57.2 U6.3)
uRGB_B_2: MCU (R167.2), RGB_LED (Opto19.2)
uRGB_G_2: MCU (R168.2), RGB_LED (Opto18.2)
uRGB_R_2: MCU (R169.2), RGB_LED (Opto17.2)
uSlave_RX_2: MCU (R59.2), Interface (D53.2 U5.5)
uSlave_TX_2: MCU (R57.2), Interface (D54.2 U5.3)
uWiFi_RX_2: MCU (R163.2), Comm (SWD2.2 U19.37)
uWiFi_TX_2: MCU (R164.2), Comm (SWD2.1 U19.36)
VREF: Power (U10.6), MCU (FB2.2)